# EAGLE board MDE-DR-4 (EAGLE 6.4), part 1 of 3
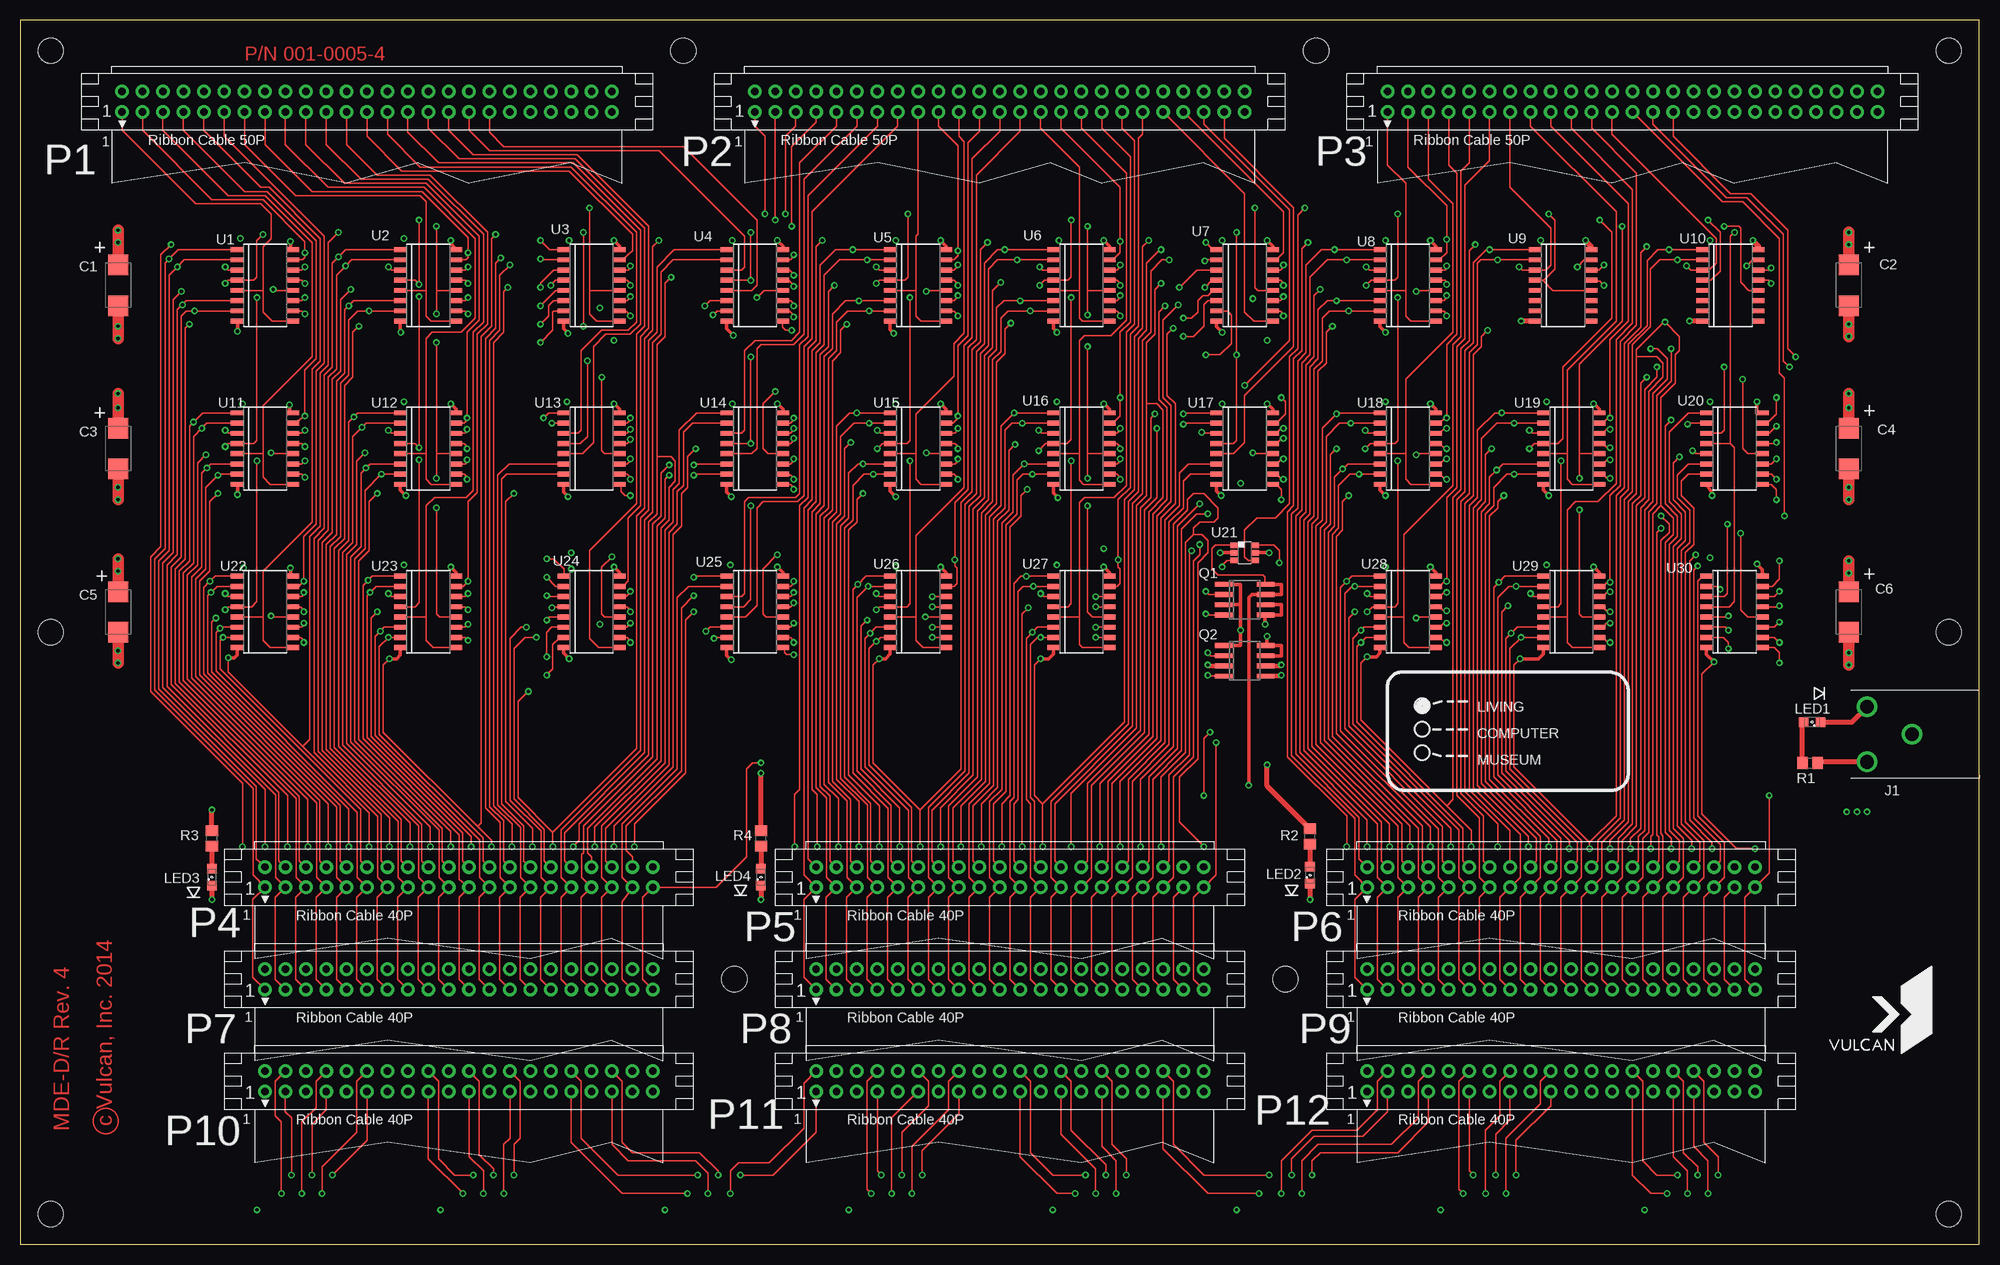
[diagram p4: board, top side]
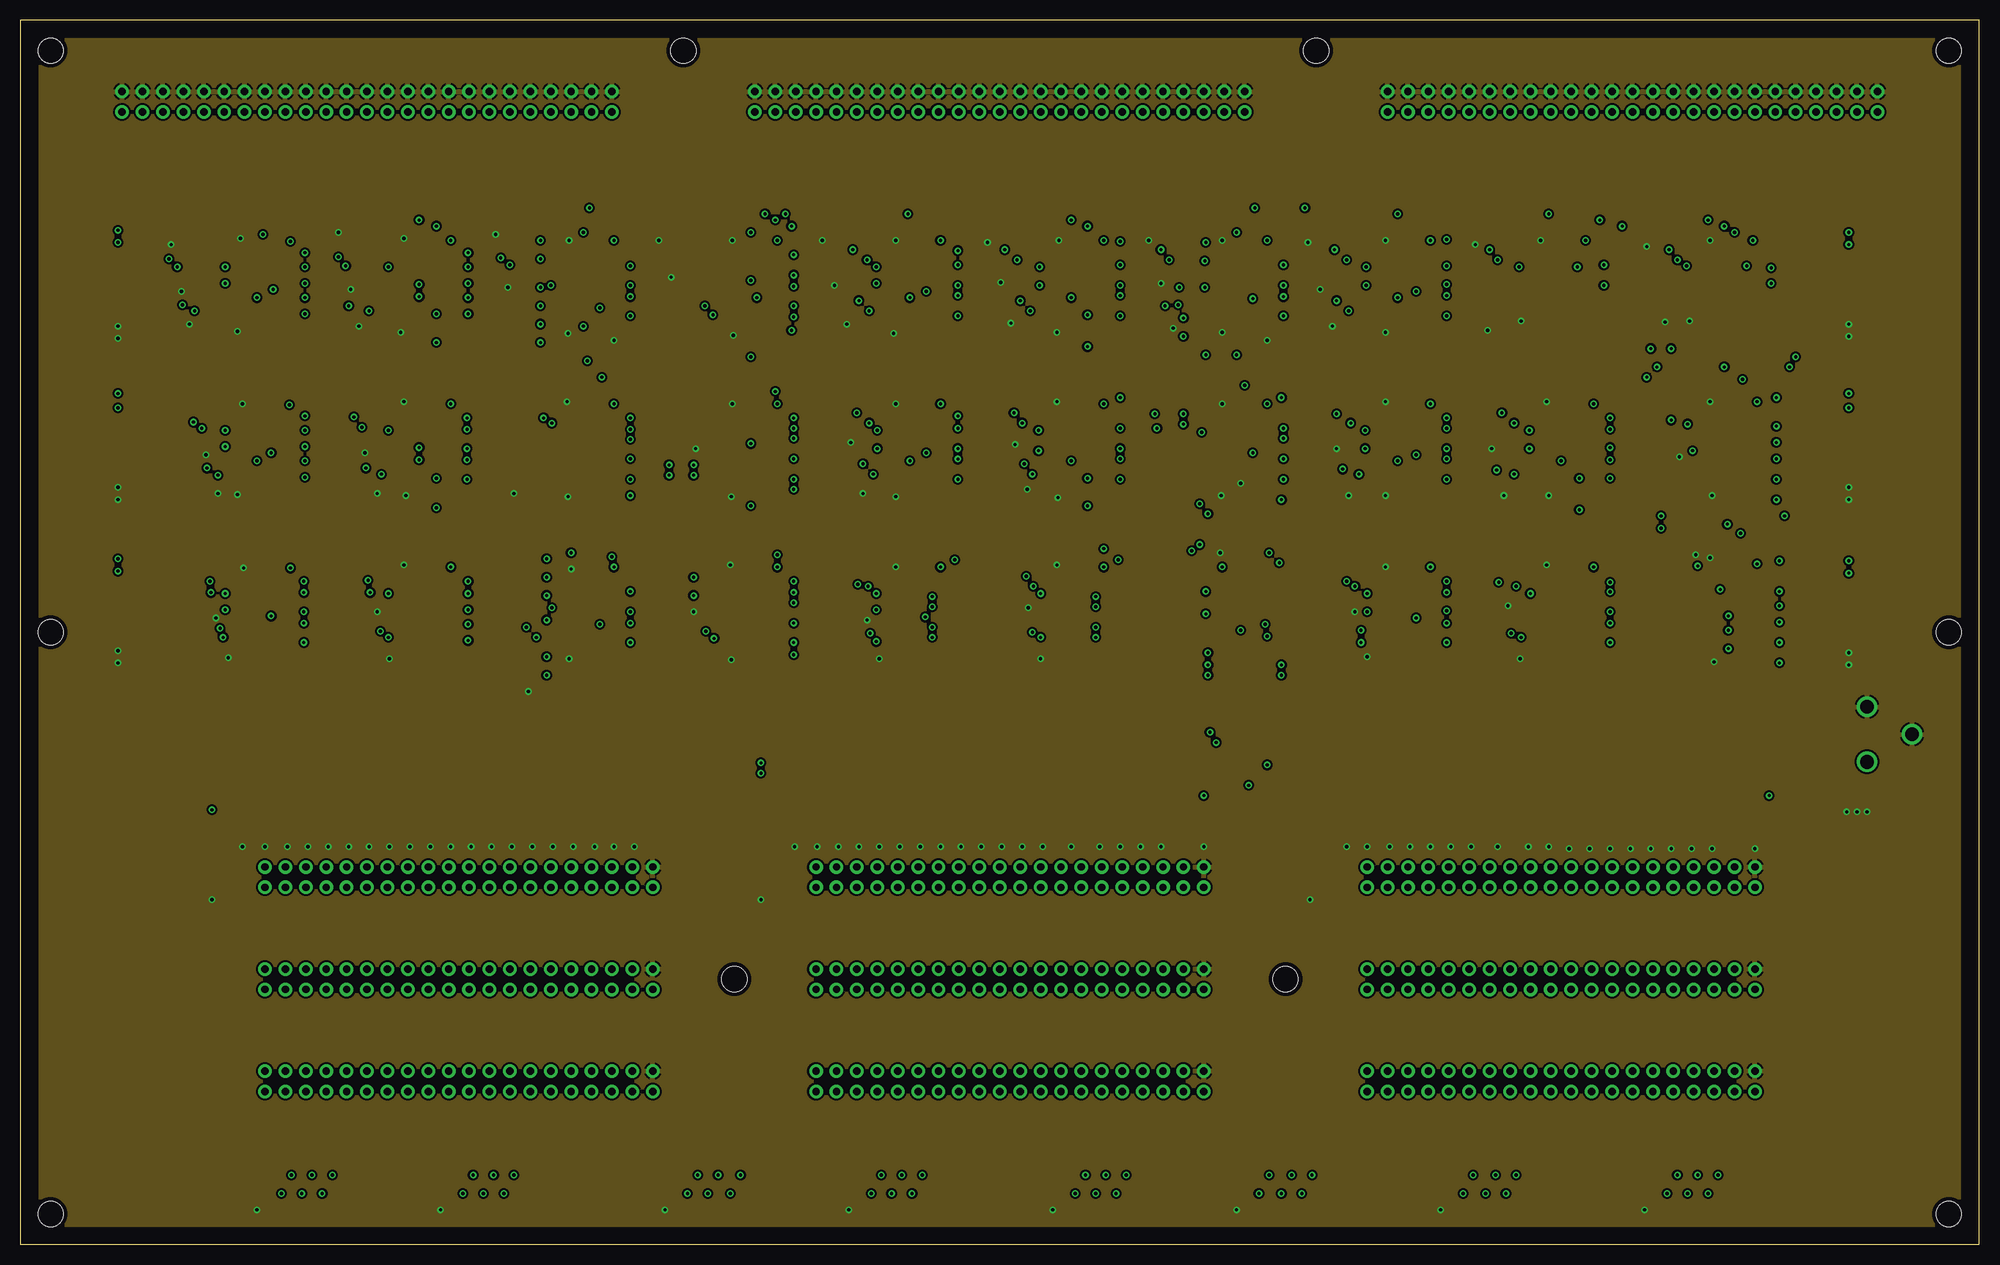
[diagram p5: board, inner layer GND]
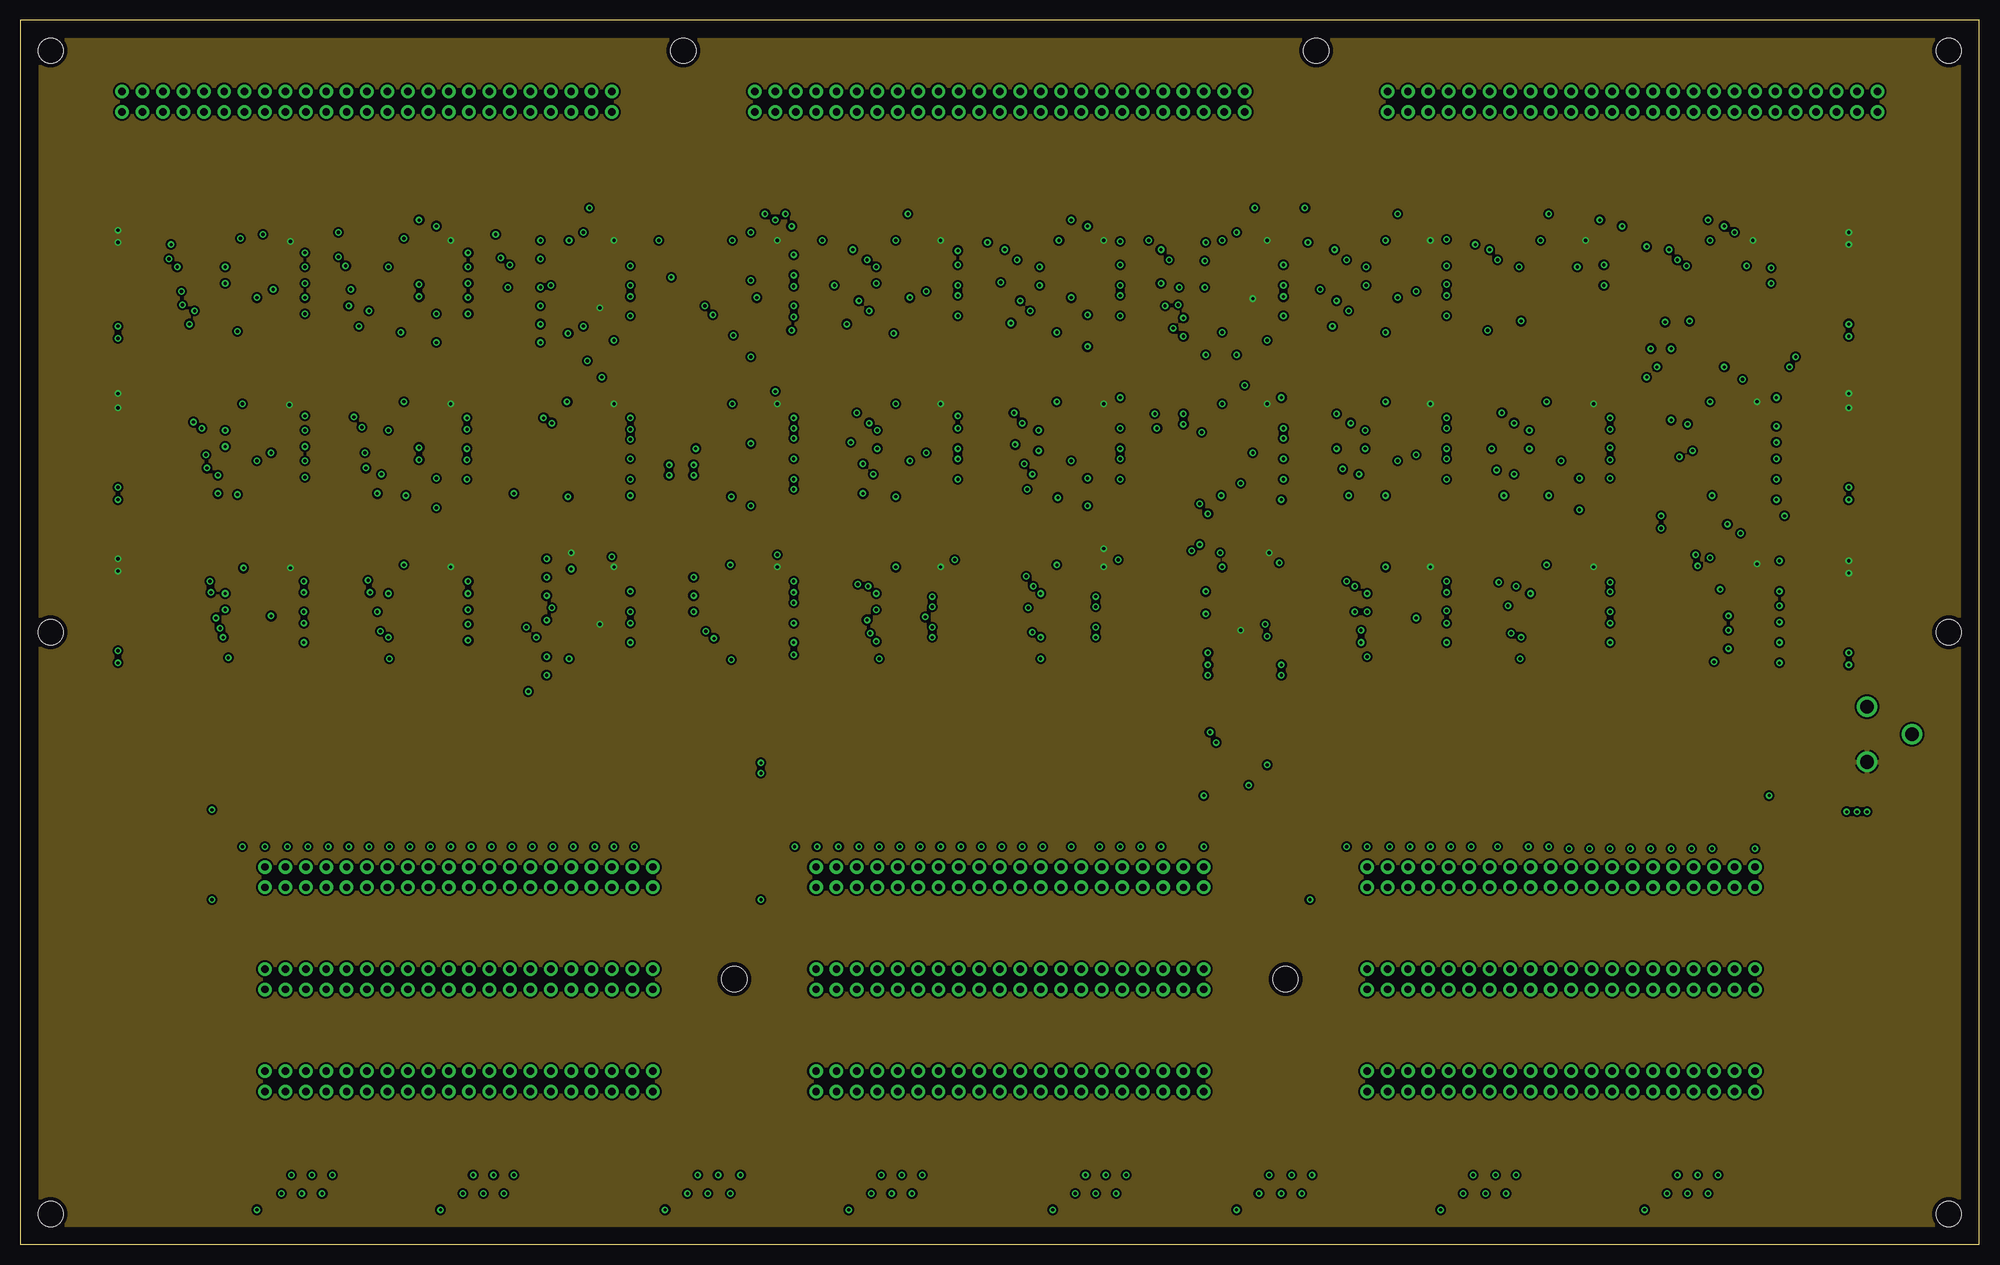
[diagram p6: board, inner layer PWR]
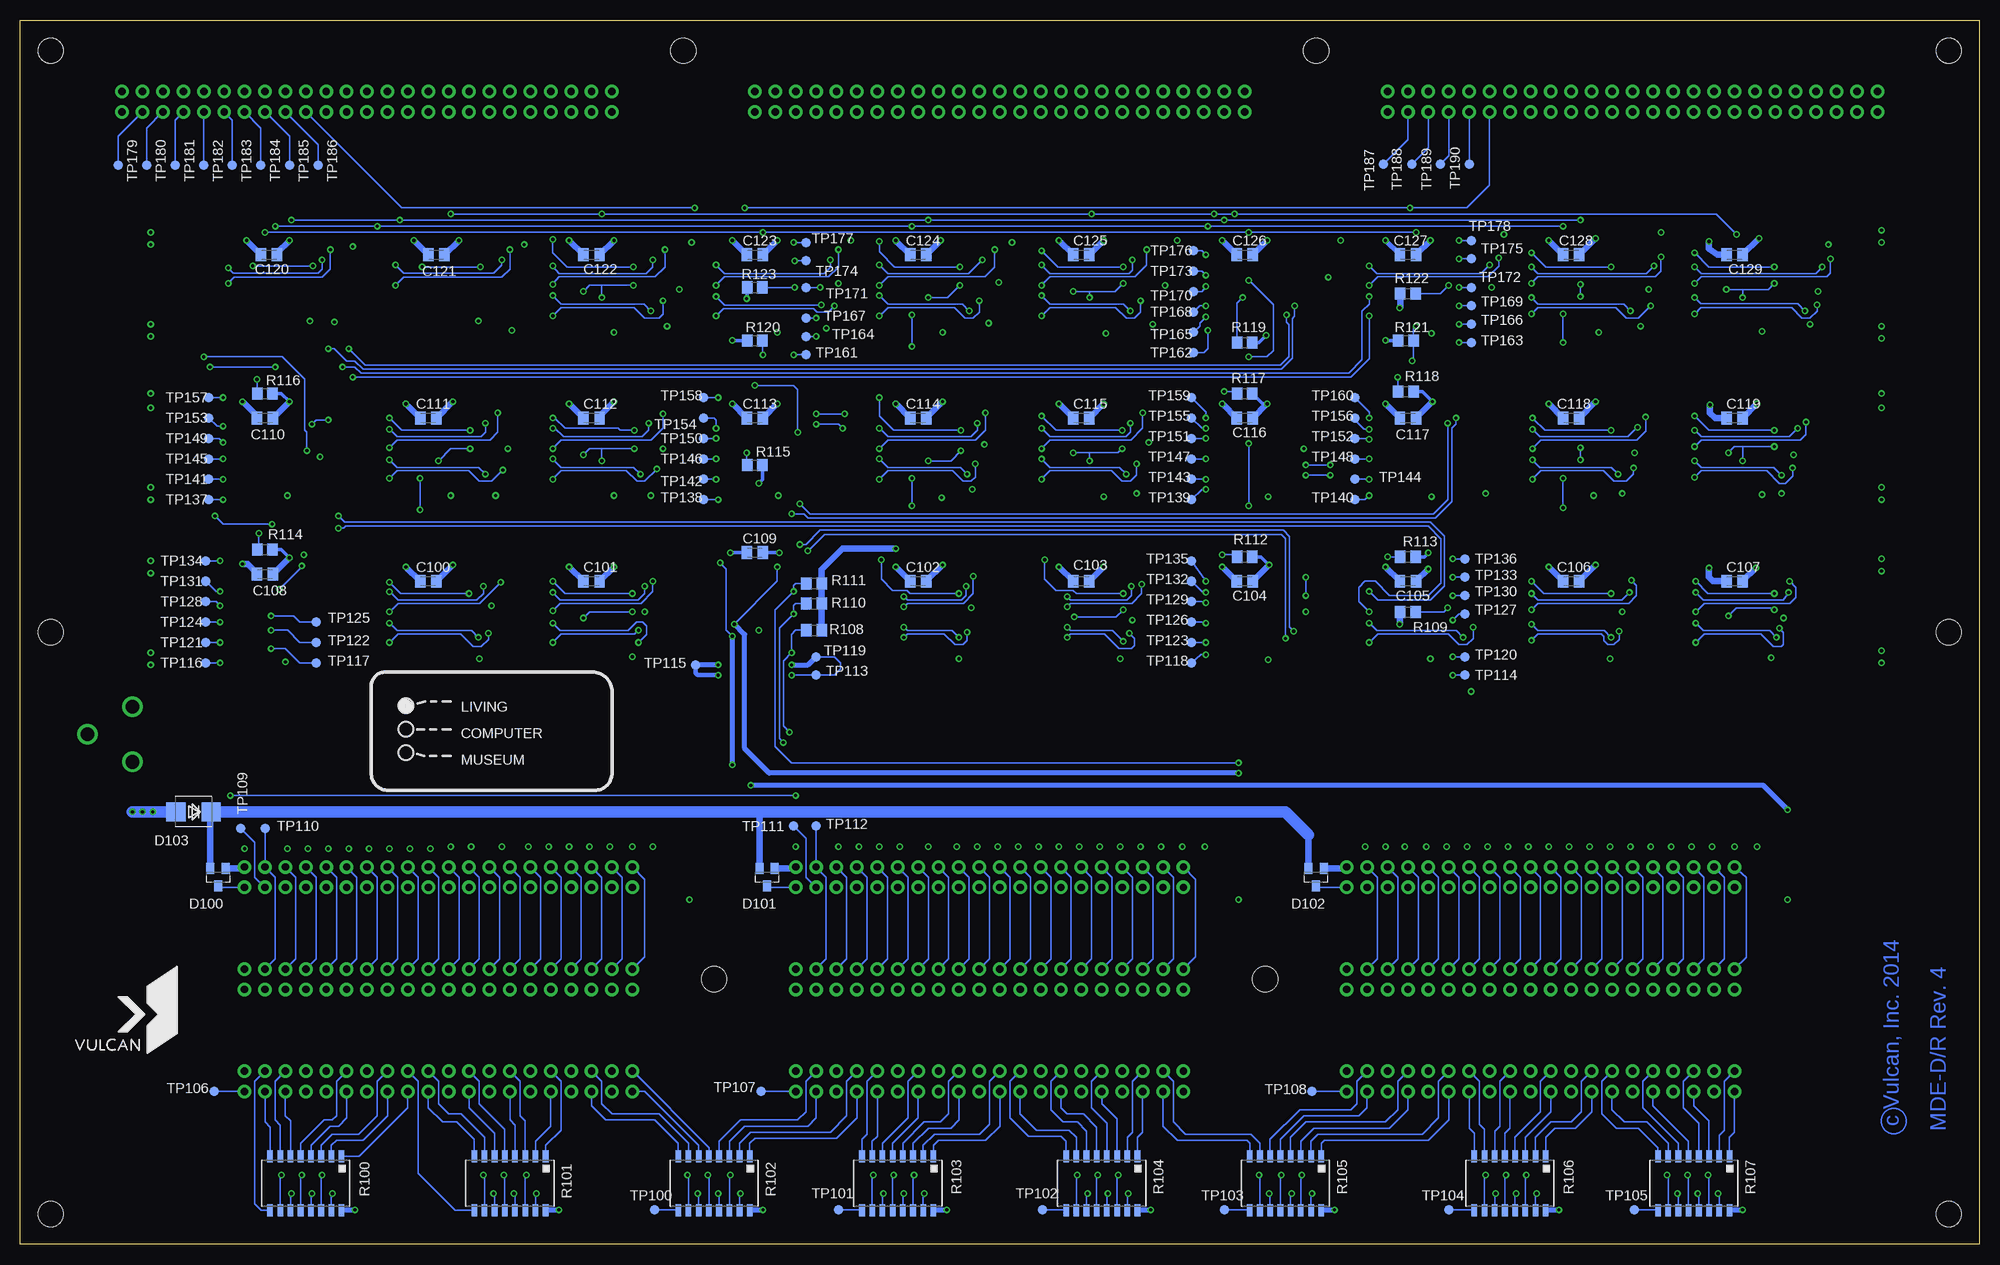
[diagram p7: board, bottom side, seen from below]

Size 243.84 x 152.4 mm. Coordinates in mm from the lower left corner, seen from the top.
Outline: 0,0 243.84,0 243.84,152.4 0,152.4 0,0
Copper layers (1+2*3+16): Top 0.035mm / dielectric 1.5mm / GND 0.035mm / dielectric 0.15mm / PWR 0.035mm / dielectric 0.2mm / Bottom 0.035mm
Design rules "dd60i *": minimum track width 8mil, minimum drill 16mil, track to track 8mil, track to pad 8mil, pad to pad 8mil, via to via 8mil, smd to smd 8mil, copper to edge 0.5mm, drill to drill 0.5mm, minimum pad ring 10mil, minimum via ring 8mil, stop-mask expansion 4mil, vias tented up to drill 20mil, thermal gap 10mil
Holes 3.17 mm at 3.81,3.81 240.03,3.81 240.03,148.59 3.81,148.59 3.81,76.2 240.03,76.2 88.9,33.02 157.48,33.02 82.55,148.59 161.29,148.59

## Footprints (pad centres in the part's own frame; a part is rotated, then mirrored left to right if it is on the bottom)
C/6032-28R = smd 2.55 x 2.5: + 2.525,0; - -2.525,0
C0805K = smd 1.3 x 1.6: 1 -1,0; 2 1,0
SOT23 = smd 1 x 1.4: 1 -0.95,-1.1; 2 0.95,-1.1; 3 0,1.1
SMB = smd 2.4 x 2.4: A 2.2,0; C -2.2,0
712RA = drill 1.702: PIN 0,3.429; SLEEVE -5.588,0; SLEEVE_SHUNT 0,-3.429
SML0805 = smd 1.2 x 1.2: A 1.05,0; C -1.05,0
CON50L = drill 0.914 pad 1.676: 1 30.48,1.27; 2 30.48,-1.27; 3 27.94,1.27; 4 27.94,-1.27; 5 25.4,1.27; 6 25.4,-1.27; 7 22.86,1.27; 8 22.86,-1.27; 9 20.32,1.27; 10 20.32,-1.27; 11 17.78,1.27; 12 17.78,-1.27; 13 15.24,1.27; 14 15.24,-1.27; 15 12.7,1.27; 16 12.7,-1.27; 17 10.16,1.27; 18 10.16,-1.27; 19 7.62,1.27; 20 7.62,-1.27; 21 5.08,1.27; 22 5.08,-1.27; 23 2.54,1.27; 24 2.54,-1.27; 25 0,1.27; 26 0,-1.27; 27 -2.54,1.27; 28 -2.54,-1.27; 29 -5.08,1.27; 30 -5.08,-1.27; 31 -7.62,1.27; 32 -7.62,-1.27; 33 -10.16,1.27; 34 -10.16,-1.27; 35 -12.7,1.27; 36 -12.7,-1.27; 37 -15.24,1.27; 38 -15.24,-1.27; 39 -17.78,1.27; 40 -17.78,-1.27; 41 -20.32,1.27; 42 -20.32,-1.27; 43 -22.86,1.27; 44 -22.86,-1.27; 45 -25.4,1.27; 46 -25.4,-1.27; 47 -27.94,1.27; 48 -27.94,-1.27; 49 -30.48,1.27; 50 -30.48,-1.27
CON40L = drill 0.914 pad 1.676: 1 24.13,1.27; 2 24.13,-1.27; 3 21.59,1.27; 4 21.59,-1.27; 5 19.05,1.27; 6 19.05,-1.27; 7 16.51,1.27; 8 16.51,-1.27; 9 13.97,1.27; 10 13.97,-1.27; 11 11.43,1.27; 12 11.43,-1.27; 13 8.89,1.27; 14 8.89,-1.27; 15 6.35,1.27; 16 6.35,-1.27; 17 3.81,1.27; 18 3.81,-1.27; 19 1.27,1.27; 20 1.27,-1.27; 21 -1.27,1.27; 22 -1.27,-1.27; 23 -3.81,1.27; 24 -3.81,-1.27; 25 -6.35,1.27; 26 -6.35,-1.27; 27 -8.89,1.27; 28 -8.89,-1.27; 29 -11.43,1.27; 30 -11.43,-1.27; 31 -13.97,1.27; 32 -13.97,-1.27; 33 -16.51,1.27; 34 -16.51,-1.27; 35 -19.05,1.27; 36 -19.05,-1.27; 37 -21.59,1.27; 38 -21.59,-1.27; 39 -24.13,1.27; 40 -24.13,-1.27
SO-08 = smd 0.6 x 2.2: 1 -1.905,-2.6; 2 -0.635,-2.6; 3 0.635,-2.6; 4 1.905,-2.6; 5 1.905,2.6; 6 0.635,2.6; 7 -0.635,2.6; 8 -1.905,2.6
R0805 = smd 1.3 x 1.5: 1 -0.95,0; 2 0.95,0
4816P = smd 0.7 x 1.5: 1 -4.445,-3.346; 2 -3.175,-3.346; 3 -1.905,-3.346; 4 -0.635,-3.346; 5 0.635,-3.346; 6 1.905,-3.346; 7 3.175,-3.346; 8 4.445,-3.346; 9 4.445,3.346; 10 3.175,3.346; 11 1.905,3.346; 12 0.635,3.346; 13 -0.635,3.346; 14 -1.905,3.346; 15 -3.175,3.346; 16 -4.445,3.346
TP12R = smd 1.2 x 1.2: TP 0,0
SO16NS = smd 0.6 x 1.5: 1 -4.445,-3.49; 2 -3.175,-3.49; 3 -1.905,-3.49; 4 -0.635,-3.49; 5 0.635,-3.49; 6 1.905,-3.49; 7 3.175,-3.49; 8 4.445,-3.49; 9 4.445,3.49; 10 3.175,3.49; 11 1.905,3.49; 12 0.635,3.49; 13 -0.635,3.49; 14 -1.905,3.49; 15 -3.175,3.49; 16 -4.445,3.49
DBV_R-PDSO-G6 = smd 0.69 x 0.99: 1 -0.95,-1.29; 2 0,-1.29; 3 0.95,-1.29; 4 0.95,1.3; 5 0,1.3; 6 -0.95,1.3

## Placement (x,y rotation side)
C1  47u  [C/6032-28R]  12.19,119.38 90 top
C2  47u  [C/6032-28R]  227.58,119.38 90 top
C3  47u  [C/6032-28R]  12.19,99.06 90 top
C4  47u  [C/6032-28R]  227.58,99.06 90 top
C5  47u  [C/6032-28R]  12.19,78.74 90 top
C6  47u  [C/6032-28R]  227.58,78.74 90 top
C100  0.01u  [C0805K]  193.04,82.55 0 bottom
C101  0.01u  [C0805K]  172.72,82.55 0 bottom
C102  0.01u  [C0805K]  132.08,82.55 0 bottom
C103  0.01u  [C0805K]  111.76,82.55 0 bottom
C104  0.01u  [C0805K]  91.44,82.55 0 bottom
C105  0.01u  [C0805K]  71.12,82.55 0 bottom
C106  0.01u  [C0805K]  50.8,82.55 0 bottom
C107  0.01u  [C0805K]  30.48,82.55 0 bottom
C108  0.01u  [C0805K]  213.36,83.44 0 bottom
C109  0.01u  [C0805K]  152.4,86.11 0 bottom
C110  0.01u  [C0805K]  213.36,102.87 0 bottom
C111  0.01u  [C0805K]  193.04,102.87 0 bottom
C112  0.01u  [C0805K]  172.72,102.87 0 bottom
C113  0.01u  [C0805K]  152.4,102.87 0 bottom
C114  0.01u  [C0805K]  132.08,102.87 0 bottom
C115  0.01u  [C0805K]  111.76,102.87 0 bottom
C116  0.01u  [C0805K]  91.44,102.87 0 bottom
C117  0.01u  [C0805K]  71.12,102.87 0 bottom
C118  0.01u  [C0805K]  50.8,102.87 0 bottom
C119  0.01u  [C0805K]  30.48,102.87 0 bottom
C120  0.01u  [C0805K]  212.85,123.19 0 bottom
C121  0.01u  [C0805K]  192.02,123.19 0 bottom
C122  0.01u  [C0805K]  172.72,123.19 0 bottom
C123  0.01u  [C0805K]  152.4,123.19 0 bottom
C124  0.01u  [C0805K]  132.08,123.19 0 bottom
C125  0.01u  [C0805K]  111.76,123.19 0 bottom
C126  0.01u  [C0805K]  91.44,123.19 0 bottom
C127  0.01u  [C0805K]  71.12,123.19 0 bottom
C128  0.01u  [C0805K]  50.8,123.19 0 bottom
C129  0.01u  [C0805K]  30.48,123.19 0 bottom
D100  HSMS-2822  [SOT23]  219.2,45.72 180 bottom
D101  HSMS-2822  [SOT23]  150.88,45.72 180 bottom
D102  HSMS-2822  [SOT23]  82.55,45.72 180 bottom
D103  1SMB5918BT3G  [SMB]  222.25,53.85 180 bottom
DRILEGEND  [DRILEGEND]  41.59,-11.49 0 top  (outside the outline)
J1  712RA  [712RA]  229.87,63.5 180 top
LED1  APT2012SGC  [SML0805]  223.01,65.02 180 top
LED2  APT2012EC  [SML0805]  160.53,45.97 90 top
LED3  APT2012EC  [SML0805]  23.88,45.72 90 top
LED4  APT2012EC  [SML0805]  92.2,45.72 90 top
P1  [CON50L]  43.18,142.24 180 top
P2  [CON50L]  121.92,142.24 180 top
P3  [CON50L]  200.66,142.24 180 top
P4  [CON40L]  54.61,45.72 180 top
P5  [CON40L]  123.19,45.72 180 top
P6  [CON40L]  191.77,45.72 180 top
P7  [CON40L]  54.61,33.02 180 top
P8  [CON40L]  123.19,33.02 180 top
P9  [CON40L]  191.77,33.02 180 top
P10  [CON40L]  54.61,20.32 180 top
P11  [CON40L]  123.19,20.32 180 top
P12  [CON40L]  191.77,20.32 180 top
Q1  IRF7104PBF  [SO-08]  152.4,80.26 270 top
Q2  IRF7104PBF  [SO-08]  152.4,72.64 270 top
R1  150  [R0805]  222.76,59.94 0 top
R2  150  [R0805]  160.53,50.8 90 top
R3  150  [R0805]  23.88,50.55 90 top
R4  150  [R0805]  92.2,50.55 90 top
R100  4816P-T02-820LF  [4816P]  208.28,7.62 180 bottom
R101  4816P-T02-820LF  [4816P]  182.88,7.62 180 bottom
R102  4816P-T02-820LF  [4816P]  157.48,7.62 180 bottom
R103  4816P-T02-820LF  [4816P]  134.62,7.62 180 bottom
R104  4816P-T02-820LF  [4816P]  109.22,7.62 180 bottom
R105  4816P-T02-820LF  [4816P]  86.36,7.62 180 bottom
R106  4816P-T02-820LF  [4816P]  58.42,7.62 180 bottom
R107  4816P-T02-820LF  [4816P]  35.56,7.62 180 bottom
R108  10k  [R0805]  145.03,76.45 0 bottom
R109  1.0k  [R0805]  71.12,78.74 0 bottom
R110  10k  [R0805]  145.03,79.76 0 bottom
R111  10k  [R0805]  145.03,82.3 0 bottom
R112  1.0k  [R0805]  91.44,85.6 0 bottom
R113  1.0k  [R0805]  71.12,85.6 0 bottom
R114  1.0k  [R0805]  213.36,86.49 0 bottom
R115  1.0k  [R0805]  152.4,97.03 0 bottom
R116  1.0k  [R0805]  213.36,105.92 0 bottom
R117  1.0k  [R0805]  91.44,105.92 0 bottom
R118  1.0k  [R0805]  71.37,106.17 0 bottom
R119  1.0k  [R0805]  91.44,112.27 0 bottom
R120  1.0k  [R0805]  152.4,112.52 0 bottom
R121  1.0k  [R0805]  71.37,112.52 0 bottom
R122  1.0k  [R0805]  71.12,118.36 0 bottom
R123  1.0k  [R0805]  152.4,119.13 0 bottom
TP100  TPSTP12R  [TP12R]  164.85,4.32 0 bottom
TP101  TPSTP12R  [TP12R]  141.99,4.32 0 bottom
TP102  TPSTP12R  [TP12R]  116.59,4.32 0 bottom
TP103  TPSTP12R  [TP12R]  93.98,4.32 0 bottom
TP104  TPSTP12R  [TP12R]  66.04,4.32 0 bottom
TP105  TPSTP12R  [TP12R]  42.93,4.32 0 bottom
TP106  TPSTP12R  [TP12R]  219.71,19.05 0 bottom
TP107  TPSTP12R  [TP12R]  151.64,19.05 0 bottom
TP108  TPSTP12R  [TP12R]  83.06,19.05 0 bottom
TP109  TPSTP12R  [TP12R]  216.41,51.82 90 bottom
TP110  TPSTP12R  [TP12R]  213.36,51.82 90 bottom
TP111  TPSTP12R  [TP12R]  147.57,52.07 0 bottom
TP112  TPSTP12R  [TP12R]  144.78,52.07 0 bottom
TP113  TPSTP12R  [TP12R]  144.78,70.87 270 bottom
TP114  TPSTP12R  [TP12R]  64.01,70.87 0 bottom
TP115  TPSTP12R  [TP12R]  159.77,72.14 270 bottom
TP116  TPSTP12R  [TP12R]  220.73,72.39 0 bottom
TP117  TPSTP12R  [TP12R]  207.01,72.39 270 bottom
TP118  TPSTP12R  [TP12R]  98.04,72.39 0 bottom
TP119  TPSTP12R  [TP12R]  144.78,73.15 270 bottom
TP120  TPSTP12R  [TP12R]  64.01,73.15 0 bottom
TP121  TPSTP12R  [TP12R]  220.73,74.93 0 bottom
TP122  TPSTP12R  [TP12R]  207.01,74.93 270 bottom
TP123  TPSTP12R  [TP12R]  98.04,74.93 0 bottom
TP124  TPSTP12R  [TP12R]  220.73,77.47 0 bottom
TP125  TPSTP12R  [TP12R]  207.01,77.47 0 bottom
TP126  TPSTP12R  [TP12R]  98.04,77.47 0 bottom
TP127  TPSTP12R  [TP12R]  64.01,78.49 0 bottom
TP128  TPSTP12R  [TP12R]  220.73,80.01 0 bottom
TP129  TPSTP12R  [TP12R]  98.04,80.01 0 bottom
TP130  TPSTP12R  [TP12R]  64.01,80.77 0 bottom
TP131  TPSTP12R  [TP12R]  220.73,82.55 0 bottom
TP132  TPSTP12R  [TP12R]  98.04,82.55 0 bottom
TP133  TPSTP12R  [TP12R]  64.01,83.06 0 bottom
TP134  TPSTP12R  [TP12R]  220.73,85.09 0 bottom
TP135  TPSTP12R  [TP12R]  98.04,85.09 0 bottom
TP136  TPSTP12R  [TP12R]  64.01,85.34 0 bottom
TP137  TPSTP12R  [TP12R]  220.34,92.71 0 bottom
TP138  TPSTP12R  [TP12R]  158.75,92.71 0 bottom
TP139  TPSTP12R  [TP12R]  98.04,92.71 0 bottom
TP140  TPSTP12R  [TP12R]  77.72,92.71 0 bottom
TP141  TPSTP12R  [TP12R]  220.34,95.25 0 bottom
TP142  TPSTP12R  [TP12R]  158.75,95.25 0 bottom
TP143  TPSTP12R  [TP12R]  98.04,95.25 0 bottom
TP144  TPSTP12R  [TP12R]  77.72,95.25 0 bottom
TP145  TPSTP12R  [TP12R]  220.34,97.79 0 bottom
TP146  TPSTP12R  [TP12R]  158.75,97.79 0 bottom
TP147  TPSTP12R  [TP12R]  98.04,97.79 0 bottom
TP148  TPSTP12R  [TP12R]  77.72,97.79 0 bottom
TP149  TPSTP12R  [TP12R]  220.34,100.33 0 bottom
TP150  TPSTP12R  [TP12R]  158.75,100.33 0 bottom
TP151  TPSTP12R  [TP12R]  98.04,100.33 0 bottom
TP152  TPSTP12R  [TP12R]  77.72,100.33 0 bottom
TP153  TPSTP12R  [TP12R]  220.34,102.87 0 bottom
TP154  TPSTP12R  [TP12R]  158.75,102.87 0 bottom
TP155  TPSTP12R  [TP12R]  98.04,102.87 0 bottom
TP156  TPSTP12R  [TP12R]  77.72,102.87 0 bottom
TP157  TPSTP12R  [TP12R]  220.34,105.41 0 bottom
TP158  TPSTP12R  [TP12R]  158.75,105.41 0 bottom
TP159  TPSTP12R  [TP12R]  98.04,105.41 0 bottom
TP160  TPSTP12R  [TP12R]  77.72,105.41 0 bottom
TP161  TPSTP12R  [TP12R]  146.05,110.74 0 bottom
TP162  TPSTP12R  [TP12R]  97.79,111 0 bottom
TP163  TPSTP12R  [TP12R]  63.25,112.27 0 bottom
TP164  TPSTP12R  [TP12R]  146.05,113.03 0 bottom
TP165  TPSTP12R  [TP12R]  97.79,113.54 0 bottom
TP166  TPSTP12R  [TP12R]  63.25,114.55 0 bottom
TP167  TPSTP12R  [TP12R]  146.05,115.32 0 bottom
TP168  TPSTP12R  [TP12R]  97.79,116.08 0 bottom
TP169  TPSTP12R  [TP12R]  63.25,116.84 0 bottom
TP170  TPSTP12R  [TP12R]  97.79,118.62 0 bottom
TP171  TPSTP12R  [TP12R]  146.05,119.13 0 bottom
TP172  TPSTP12R  [TP12R]  63.25,119.13 0 bottom
TP173  TPSTP12R  [TP12R]  97.79,121.16 0 bottom
TP174  TPSTP12R  [TP12R]  146.05,122.43 0 bottom
TP175  TPSTP12R  [TP12R]  63.25,122.68 0 bottom
TP176  TPSTP12R  [TP12R]  97.79,123.7 0 bottom
TP177  TPSTP12R  [TP12R]  146.05,124.71 0 bottom
TP178  TPSTP12R  [TP12R]  63.25,124.97 0 bottom
TP179  TPSTP12R  [TP12R]  231.65,134.37 90 bottom
TP180  TPSTP12R  [TP12R]  228.09,134.37 90 bottom
TP181  TPSTP12R  [TP12R]  224.54,134.37 90 bottom
TP182  TPSTP12R  [TP12R]  220.98,134.37 90 bottom
TP183  TPSTP12R  [TP12R]  217.42,134.37 90 bottom
TP184  TPSTP12R  [TP12R]  213.87,134.37 90 bottom
TP185  TPSTP12R  [TP12R]  210.31,134.37 90 bottom
TP186  TPSTP12R  [TP12R]  206.76,134.37 90 bottom
TP187  TPSTP12R  [TP12R]  74.17,134.49 270 bottom
TP188  TPSTP12R  [TP12R]  70.61,134.49 270 bottom
TP189  TPSTP12R  [TP12R]  67.06,134.49 270 bottom
TP190  TPSTP12R  [TP12R]  63.5,134.49 270 bottom
U1  SN751177NSR"  [SO16NS]  30.48,119.38 270 top
U2  SN751177NSR"  [SO16NS]  50.8,119.38 270 top
U3  SN751177NSR"  [SO16NS]  71.12,119.38 270 top
U4  SN751177NSR"  [SO16NS]  91.44,119.38 270 top
U5  SN751177NSR"  [SO16NS]  111.76,119.38 270 top
U6  SN751177NSR"  [SO16NS]  132.08,119.38 270 top
U7  SN751177NSR"  [SO16NS]  152.4,119.38 270 top
U8  SN751177NSR"  [SO16NS]  172.72,119.38 270 top
U9  SN751177NSR"  [SO16NS]  192.02,119.38 270 top
U10  SN751177NSR"  [SO16NS]  212.85,119.38 270 top
U11  SN751177NSR"  [SO16NS]  30.48,99.06 270 top
U12  SN751177NSR"  [SO16NS]  50.8,99.06 270 top
U13  SN751177NSR"  [SO16NS]  71.12,99.06 270 top
U14  SN751177NSR"  [SO16NS]  91.44,99.06 270 top
U15  SN751177NSR"  [SO16NS]  111.76,99.06 270 top
U16  SN751177NSR"  [SO16NS]  132.08,99.06 270 top
U17  SN751177NSR"  [SO16NS]  152.4,99.06 270 top
U18  SN751177NSR"  [SO16NS]  172.72,99.06 270 top
U19  SN751177NSR"  [SO16NS]  193.04,99.06 270 top
U20  SN751177NSR"  [SO16NS]  213.36,99.06 270 top
U21  SN74LVC1G27DBV  [DBV_R-PDSO-G6]  152.4,86.11 270 top
U22  SN751177NSR"  [SO16NS]  30.48,78.74 270 top
U23  SN751177NSR"  [SO16NS]  50.8,78.74 270 top
U24  SN751177NSR"  [SO16NS]  71.12,78.74 270 top
U25  SN751177NSR"  [SO16NS]  91.44,78.74 270 top
U26  SN751177NSR"  [SO16NS]  111.76,78.74 270 top
U27  SN751177NSR"  [SO16NS]  132.08,78.74 270 top
U28  SN751177NSR"  [SO16NS]  172.72,78.74 270 top
U29  SN751177NSR"  [SO16NS]  193.04,78.74 270 top
U30  SN751177NSR"  [SO16NS]  213.36,78.74 270 top

## Tracks (layer width: path | path; a pad name or v marks a point on that pad's centre or on a via)
!IF_CTRL_RCV_EN  (via drill 0.41)
  Top 0.203: v70.1,114.3 v70.1,125.98 | v90.93,125.98 v90.93,120.02 U4.4 | U13.4 69.72,99.69 70.61,100.58 v70.61,109.98 | U14.4 v90.93,99.69 v90.93,110.49 | U25.4 90.04,79.38 90.93,80.26 v90.93,91.95 | v151.38,125.98 v151.38,110.74 151.38,100.08 151,99.69 U17.4 | U30.4 212.72,79.38 213.36,80.01 213.36,99.19 212.85,99.69 | 212.85,99.69 212.85,125.48 v213.36,125.98 | U20.4 212.85,99.69
  Bottom 0.203: v70.1,125.98 v90.93,125.98 v151.38,125.98 v213.36,125.98 | v70.1,114.3 70.42,113.98 R121.2 70.42,110.17 v70.61,109.98 | v90.93,110.49 88.65,110.49 87.88,111.25 87.88,116.97 v90.93,120.02 | v90.93,91.95 v90.93,99.69 | R120.2 151.45,110.81 v151.38,110.74
+5V  (via drill 0.41)
  Top 0.406: U2.16 53.45,124.82 v53.59,124.97 | Q1.1 151.89,82.17 151.89,79.63 | Q1.3 151.89,79.63 | Q2.1 151.89,74.55 v151.89,76.45 151.89,79.63 | U21.5 v155.45,86.11 | v216.15,104.9 216.15,103.5 U20.16 | 223.84,60.07 R1.2 | U1.16 33.66,123.83 v33.66,124.84 | v33.53,104.52 33.53,103.5 U11.16 | v33.66,84.2 33.66,83.19 U22.16 | v53.59,84.33 54.29,83.63 U23.16 | U12.16 54.29,103.95 v53.59,104.65 | v73.91,124.97 74.61,124.27 U3.16 | U13.16 74.61,103.95 v73.91,104.65 | U24.16 74.61,83.63 v73.91,84.33 | U25.16 94.93,83.63 v94.23,84.33 | U14.16 94.93,103.95 v94.23,104.65 | U4.16 94.93,124.27 v94.23,124.97 | U5.16 115.25,124.27 v114.55,124.97 | U15.16 115.25,103.95 v114.55,104.65 | U26.16 115.25,83.63 v114.55,84.33 | U27.16 135.57,83.63 v134.87,84.33 | U16.16 135.57,103.95 v134.87,104.65 | U6.16 135.57,124.27 v134.87,124.97 | U7.16 155.89,124.27 v155.19,124.97 | U17.16 155.89,103.95 v155.19,104.65 | U8.16 176.21,124.27 v175.51,124.97 | U18.16 176.21,103.95 v175.51,104.65 | U28.16 176.21,83.63 v175.51,84.33 | U29.16 196.53,83.63 v195.83,84.33 | U19.16 196.53,103.95 v195.83,104.65 | U30.16 216.85,84.01 v216.15,84.71
  Top 0.61: J1.PIN 223.84,60.07 | v194.82,124.97 195.51,124.27 U9.16 | v215.65,124.97 216.34,124.27 U10.16
  Top 1.422: C1.+ v12.19,126.24 | C3.+ v12.19,105.92 | C5.+ v12.19,85.34 | C2.+ v227.58,125.98 | C4.+ v227.58,105.92 | C6.+ v227.58,85.09
  Bottom 0.203: C129.1 31.5,123.19
  Bottom 0.406: R113.2 69.09,85.6 v68.58,86.11 | 153.65,122.94 C123.1 | 154.94,86.11 v155.45,86.11 C109.1 | R123.1 153.35,117.92 v153.42,117.73
  Bottom 0.61: C127.1 72.14,123.19 v73.91,124.97
  Bottom 0.813: 31.5,123.19 32.64,123.19 33.66,123.95 v33.66,124.84 | v33.53,104.52 33.53,103.5 32.89,102.87 C119.1 | C107.1 33.15,82.55 33.66,83.06 v33.66,84.2 | v53.59,124.97 51.82,123.19 C128.1 | v53.59,104.65 51.82,102.87 C118.1 | v53.59,84.33 51.82,82.55 C106.1 | C117.1 72.14,102.87 v73.91,104.65 | C105.1 72.14,82.55 v73.91,84.33 | C104.1 92.46,82.55 v94.23,84.33 | C116.1 94.22,104.65 v94.23,104.65 | C126.1 94.22,124.97 v94.23,124.97 | C103.1 114.54,84.33 v114.55,84.33 | C115.1 114.54,104.65 v114.55,104.65 | C125.1 114.54,124.97 v114.55,124.97 | C124.1 133.1,123.19 v134.87,124.97 | C114.1 134.86,104.65 v134.87,104.65 | C102.1 134.86,84.33 v134.87,84.33 | C123.1 153.42,123.19 v155.19,124.97 | R122.1 72.07,116.65 v72.14,116.59 | R109.1 72.14,78.67 v72.14,77.22 | C113.1 153.42,102.87 v155.19,104.65 | R108.2 R110.2 R111.2 144.08,84.01 141.48,86.61 v134.87,86.61 | C122.1 173.74,123.19 v175.51,124.97 | C112.1 173.74,102.87 v175.51,104.65 | C101.1 173.74,82.55 v175.51,84.33 | C121.1 193.04,123.19 v194.82,124.97 | C111.1 194.06,102.87 v195.83,104.65 | C100.1 194.06,82.55 v195.83,84.33 | C108.1 214.36,83.68 214.5,83.69 215.52,84.71 v216.15,84.71 | C110.1 214.36,103.11 v216.15,104.9 | C120.1 213.87,123.19 v215.65,124.97
  other vias: 12.19,124.71 12.19,104.14 12.19,83.82 227.58,124.46 227.58,104.14 227.58,83.57
  pour PWR (isolate 0.254): 2.54,2.54 241.3,2.54 241.3,149.86 2.54,149.86
CABLE_A_FAIL  (via drill 0.41)
  Top 0.203: v92.2,59.94 91.19,59.94 90.42,59.18 90.42,48.26 86.61,44.45 P4.39 77.47,43.18 77.47,33.02 P7.39 | Q1.2 147.96,80.9 v147.57,81.28
  Bottom 0.203: P4.39 82.38,44.45 D102.3 | v92.2,59.94 147.83,59.94 149.86,61.98 149.86,78.99 v147.57,81.28 147.57,82.04 147.32,82.3 R111.1
CABLE_B_FAIL  (via drill 0.41)
  Top 0.203: P8.39 146.05,33.02 146.05,43.18 P5.39 148.84,45.97 v148.84,62.48 | Q1.4 147.7,78.36 v147.57,78.49
  Bottom 0.203: P5.39 150.71,44.45 D101.3 | R110.1 147.32,79.76 147.57,79.5 v147.57,78.49 149.35,76.71 149.35,62.99 v148.84,62.48
CABLE_C_FAIL  (via drill 0.41)
  Top 0.203: P9.39 214.63,33.02 214.63,43.18 P6.39 217.68,46.23 v217.68,55.88 | Q2.2 148.21,73.28 v147.83,73.66 | v147.32,55.88 147.32,62.99 v148.08,63.75
  Bottom 0.203: P6.39 219.03,44.45 D100.3 | R108.1 147.32,76.45 147.83,75.95 v147.83,73.66 148.84,72.64 148.84,64.52 v148.08,63.75 | v217.68,55.88 v147.32,55.88
CLAMP
  Bottom 0.813: D102.2 83.5,50.99 | D101.2 151.83,53.78 151.89,53.85 | D100.2 220.15,53.78 220.22,53.85
  Bottom 1.422: 83.5,50.99 86.36,53.85 151.89,53.85 D103.C 220.22,53.85
CTRL_BUS_EN  (via drill 0.41)
  Top 0.203: 53.85,118.75 U2.12 51.82,118.75 | 51.82,118.75 v51.82,115.82 | v51.82,112.27 51.82,98.42 | U12.12 51.82,98.42 | v51.82,126.75 51.82,118.75 | U23.12 52.2,78.11 51.82,78.49 v51.82,91.69 | v51.82,95.38 51.82,98.42 | U6.12 132.84,118.75 | 132.84,118.75 v132.84,126.75 | U16.12 132.84,98.42 | 132.84,98.42 v132.84,111.76 | v132.84,115.7 132.84,118.75 | U27.12 133.48,78.11 132.84,78.74 v132.84,91.95 | v132.84,95.38 132.84,98.42 | P2.7 99.06,139.7 96.01,136.65 v96.01,126.75 | U19.12 194.06,98.42 | 194.06,98.42 194.06,109.6 199.39,114.94 v199.39,126.75 | U29.12 194.44,78.11 194.06,78.49 v194.06,91.44 | v194.06,95.38 194.06,98.42 | v212.09,126.75 213.87,126.75 214.12,126.49 214.12,119.76 215.14,118.75 U10.12
  Bottom 0.203: v51.82,115.82 v51.82,112.27 | v51.82,126.75 v96.01,126.75 v132.84,126.75 v199.39,126.75 v212.09,126.75 | v51.82,91.69 v51.82,95.38 | v132.84,111.76 v132.84,115.7 | v132.84,91.95 v132.84,95.38 | v194.06,91.44 v194.06,95.38
FROM_MB_CTOD
  Top 0.203: U14.5 91.06,98.42 91.69,99.06 91.69,111.51 92.2,112.01 96.27,112.01 97.54,113.28 97.54,132.59 104.14,139.19 P2.11
FROM_MB_DEM  (via drill 0.41)
  Top 0.203: U30.3 212.09,80.64 212.47,81.03 v212.47,89.66 | v219.58,90.68 219.58,107.82 218.95,108.46 218.95,125.22 214.38,129.79 211.84,129.79 P3.25
  Bottom 0.203: v212.47,89.66 218.57,89.66 v219.58,90.68
FROM_MB_DS00
  Top 0.203: U4.5 91.06,118.75 91.69,119.38 91.69,127.25 91.69,127.51 82.55,136.65 79.76,136.65 60.2,136.65 58.42,138.43 P1.37
FROM_MB_DS01  (via drill 0.41)
  Top 0.203: U20.3 211.71,100.97 212.09,101.35 v212.09,109.22 | v220.22,109.22 219.46,109.98 219.46,125.73 214.88,130.3 212.34,130.3 203.2,139.45 P3.27
  Bottom 0.203: v212.09,109.22 v220.22,109.22
FROM_MB_DS02  (via drill 0.41)
  Top 0.203: U20.5 208.53,98.42 v208.15,98.81 | v220.98,110.49 219.96,111.51 219.96,126.24 215.39,130.81 212.85,130.81 205.74,137.92 P3.29
  Bottom 0.203: v208.15,98.81 208.15,101.09 208.41,101.35 208.41,107.7 211.2,110.49 v220.98,110.49
FROM_MB_FAIL  (via drill 0.41)
  Top 0.203: U21.4 152.84,85.16 152.4,85.6 152.4,88.9 153.92,90.42 156.21,90.42 157.99,92.2 157.99,110.49 159,111.51 159,128.14 v159.89,129.03
  Bottom 0.203: v159.89,129.03 196.34,129.03 P3.31
FROM_MB_INIT
  Top 0.203: U25.5 90.3,78.11 91.69,79.5 91.69,91.69 92.46,92.46 96.77,92.46 97.54,93.22 97.54,111.76 98.55,112.78 98.55,128.52 109.22,139.19 P2.15
FROM_MB_RS00  (via drill 0.41)
  Top 0.203: U17.3 147.19,100.97 v147.07,101.09 | v152.4,106.93 157.99,112.52 157.99,128.78 147.32,139.45 P2.45
  Bottom 0.203: v147.07,101.09 147.07,106.43 147.57,106.93 v152.4,106.93
FROM_MB_RS01
  Top 0.203: U17.5 151,98.42 152.4,99.82 152.4,105.66 158.5,111.76 158.5,129.03 149.86,137.67 P2.47
FROM_MB_RS02
  Top 0.203: U13.3 69.47,100.97 69.85,101.35 69.85,111.25 72.39,113.79 75.69,113.79 76.71,114.81 76.71,125.98 68.58,134.11 49.78,134.11 45.72,138.18 P1.27
FROM_MB_RS03
  Top 0.203: U13.5 69.98,98.42 71.37,99.82 71.37,111.76 72.9,113.28 75.95,113.28 77.22,114.55 77.22,126.24 68.83,134.62 52.07,134.62 48.26,138.43 P1.29
FROM_MB_RS04
  Top 0.203: U4.3 89.79,121.28 90.17,121.67 90.17,125.48 79.5,136.14 58.42,136.14 55.88,138.68 P1.35
FROM_MB_RUN
  Top 0.203: U25.3 89.79,80.64 90.17,81.03 90.17,92.46 90.68,92.96 96.52,92.96 97.03,93.47 97.03,102.11 97.03,112.01 98.04,113.03 98.04,130.56 106.68,139.19 P2.13
FROM_MB_WCLK
  Top 0.203: U14.3 89.79,100.97 90.17,101.35 90.17,111.25 91.44,112.52 96.01,112.52 97.03,113.54 97.03,134.62 101.6,139.19 P2.9
GND  (via drill 0.41)
  Top 0.203: v30.48,49.53 30.48,56.64 17.78,69.34 17.78,84.84 19.05,86.11 19.05,117.6 v20.07,118.62 | v33.27,49.53 33.27,55.88 19.3,69.85 19.3,84.07 20.57,85.34 20.57,114.05 v21.08,114.55 | v27.69,49.53 27.69,57.4 16.26,68.83 16.26,85.6 17.53,86.87 17.53,123.19 v18.8,124.46 | v35.81,49.53 35.81,55.37 20.83,70.36 20.83,83.31 22.1,84.58 22.1,97.28 v23.11,98.3 | v38.35,49.53 38.35,54.86 22.35,70.87 22.35,82.55 23.62,83.82 23.62,92.46 v24.64,93.47 | v40.89,49.53 40.89,54.23 23.88,71.25 23.88,77.47 v24.38,77.98 | v43.43,49.53 43.43,53.72 35.18,61.98 | 35.18,61.98 25.91,71.25 v25.91,73.03 | v39.62,125.98 38.35,124.71 38.35,109.47 37.34,108.46 37.34,89.41 36.07,88.14 36.07,62.87 35.18,61.98 | v45.97,49.53 45.97,53.09 37.59,61.47 37.59,87.38 38.86,88.65 38.86,107.7 39.88,108.71 39.88,117.6 v41.15,118.87 | v48.51,49.53 48.51,52.45 39.12,61.85 39.12,86.61 40.39,87.88 40.39,106.93 41.4,107.95 41.4,113.54 v42.16,114.3 | v51.05,49.53 51.05,51.94 40.64,62.36 40.64,85.85 41.91,87.12 41.91,97.54 v42.93,98.55 | v53.59,49.53 53.59,51.44 42.16,62.87 42.16,85.09 43.43,86.36 43.43,92.46 v44.45,93.47 | v56.13,49.53 56.13,50.8 43.69,63.25 43.69,77.98 v44.45,78.74 | v58.67,49.53 58.67,50.29 56.96,52.01 | 56.96,52.01 45.21,63.75 45.21,72.14 v45.97,72.9 | 56.96,52.01 57.4,52.45 57.4,113.03 58.67,114.3 58.67,125.22 v59.18,125.73 | v61.21,49.53 61.21,52.32 58.93,54.61 58.93,112.27 60.2,113.54 60.2,118.62 v60.71,119.13 | v63.75,49.53 63.75,51.82 60.45,55.12 60.45,92.46 v61.47,93.47 | v66.29,49.53 66.29,51.31 | v63.25,68.83 61.98,67.56 61.98,55.63 66.29,51.31 | 66.29,51.31 76.71,61.72 76.71,90.68 77.72,91.69 77.72,112.78 78.74,113.79 78.74,124.21 v79.5,124.97
  Top 0.203: v68.83,49.53 69.6,50.29 69.6,52.32 78.23,60.96 78.23,89.92 79.25,90.93 79.25,98.04 | 79.25,98.04 79.25,112.01 80.26,113.03 80.26,119.63 v81.03,120.4 | v71.5,49.53 71.5,51.94 79.76,60.2 79.76,89.15 80.77,90.17 80.77,94.23 81.53,95 81.53,97.54 81.03,98.04 79.25,98.04 | v73.91,49.53 73.91,52.07 81.28,59.44 81.28,88.39 82.3,89.41 82.3,93.47 83.06,94.23 83.06,98.04 v84.07,99.06 | v76.45,49.53 76.45,52.32 82.8,58.67 82.8,77.72 v83.82,78.74 | v99.82,124.97 99.06,124.21 99.06,112.52 98.04,111.51 98.04,92.96 97.03,91.95 97.03,56.64 96.39,56.01 v96.39,49.53 | v101.35,119.38 100.58,118.62 100.58,111.76 99.57,110.74 99.57,92.2 98.55,91.19 98.55,56.64 99.19,56.01 v99.19,49.53 | v102.87,114.55 102.11,113.79 102.11,111 101.09,109.98 101.09,91.44 100.08,90.42 100.08,57.28 101.85,55.5 v101.85,49.53 | v103.38,99.82 102.62,99.06 102.62,90.68 101.6,89.66 101.6,57.91 104.39,55.12 v104.39,49.53 | v106.93,49.53 106.93,54.61 103.12,58.42 103.12,88.9 104.14,89.92 104.14,92.71 v104.9,93.47 | v109.47,49.53 109.47,54.36 104.65,59.18 104.65,76.96 v105.41,77.72 | v112.01,49.53 112.01,54.1 | 112.01,54.1 106.17,59.94 106.17,72.14 v106.93,72.9 | 112.01,54.1 117.09,59.18 117.09,92.33 118.49,93.73 118.49,111.38 119.51,112.39 119.51,123.83 v120.4,124.71 | v114.55,49.53 114.55,54.36 118.62,58.42 118.62,91.57 120.02,92.96 120.02,110.62 121.03,111.63 121.03,118.75 v122.05,119.76 | v123.32,114.68 122.56,113.92 122.56,110.87 121.54,109.86 121.54,92.2 120.14,90.81 120.14,57.66 117.09,54.61 v117.09,49.53 | v119.63,49.53 119.63,54.86 121.67,56.9 121.67,90.04 123.06,91.44 123.06,98.81 v123.83,99.57
  Top 0.203: v122.17,49.53 122.17,54.86 123.19,55.88 123.19,89.28 124.59,90.68 124.59,93.22 v125.35,93.98 | v124.71,49.53 124.71,78.49 v125.48,79.25 | v127.25,49.53 127.25,54.86 | 127.25,54.86 126.24,55.88 126.24,72.14 v127,72.9 | 127.25,54.86 137.41,65.02 137.41,92.71 138.68,93.98 138.68,113.03 139.7,114.05 139.7,124.21 v140.46,124.97 | v130.81,49.53 130.81,56.13 138.94,64.26 138.94,91.95 140.21,93.22 140.21,104.65 | 140.21,104.65 140.21,112.27 141.22,113.28 141.22,118.87 v141.99,119.63 | v134.37,49.53 134.37,57.4 140.46,63.5 140.46,91.19 142.24,92.96 142.24,103.89 141.48,104.65 140.21,104.65 | v136.91,49.53 136.91,57.66 141.99,62.74 141.99,90.42 143.76,92.2 143.76,104.65 142.75,105.66 142.75,113.28 v143.51,114.05 | v139.45,49.53 139.45,57.91 143.51,61.98 143.51,89.66 145.29,91.44 145.29,92.71 146.05,93.47 147.32,93.47 149.1,91.69 149.1,90.42 148.59,89.92 146.81,89.92 146.05,89.15 146.05,88.39 | v141.99,49.53 141.99,58.17 145.03,61.21 145.03,87.38 146.05,88.39 | v147.32,49.53 144.27,52.58 144.27,58.17 146.56,60.45 146.56,84.84 147.83,86.11 147.83,87.63 147.07,88.39 146.05,88.39 | v165.1,49.53 165.1,53.34 157.73,60.71 157.73,91.19 158.5,91.95 158.5,110.24 159.51,111.25 159.51,123.95 v160.27,124.71 | v167.64,49.53 167.64,52.83 159.26,61.21 159.26,90.42 160.02,91.19 160.02,109.47 161.04,110.49 161.04,118.11 v161.8,118.87 | v170.43,49.53 170.43,52.32 160.78,61.98 160.78,89.66 161.54,90.42 161.54,108.71 162.56,109.73 162.56,113.54 v163.32,114.3 | v172.97,49.53 172.97,52.07 162.31,62.74 162.31,88.9 163.07,89.66 163.07,98.3 v163.83,99.06 | v175.51,49.53 175.51,51.94 163.83,63.63 163.83,88.14 164.59,88.9 164.59,92.46 v165.35,93.22
  Top 0.203: v178.05,49.53 178.05,51.82 165.35,64.52 165.35,77.98 v166.12,78.74 | v180.59,49.53 180.59,51.56 177.55,54.61 | 177.55,54.61 166.88,65.28 166.88,72.39 v167.64,73.15 | 177.55,54.61 178.31,55.37 178.31,92.96 179.32,93.98 179.32,111.51 180.34,112.52 180.34,123.7 v181.1,124.46 | v183.9,49.53 183.9,52.32 179.83,56.39 179.83,92.2 180.85,93.22 180.85,110.74 181.86,111.76 181.86,113.03 v182.63,113.79 | v187.71,49.53 187.71,50.8 181.36,57.15 181.36,91.44 182.37,92.46 182.37,98.3 v183.13,99.06 | v190.25,49.53 190.25,50.55 182.88,57.91 182.88,90.68 183.9,91.69 183.9,92.46 v184.66,93.22 | v192.79,49.28 192.79,50.29 184.4,58.67 184.4,78.74 v185.17,79.5 | v195.33,49.28 195.33,50.04 | 195.33,50.04 185.93,59.44 185.93,72.14 v186.69,72.9 | 195.33,50.04 198.63,53.34 198.63,93.22 199.64,94.23 199.64,112.14 201.68,114.17 201.68,123.44 v202.44,124.21 | v197.87,49.28 197.87,50.29 200.15,52.58 200.15,92.46 201.17,93.47 201.17,110.49 | 201.17,110.49 201.17,111.38 204.6,114.81 v204.72,114.81 206.5,113.03 206.5,111.25 205.99,110.74 205.99,107.19 204.22,105.41 204.22,91.95 | v200.41,49.28 200.41,50.55 201.68,51.82 201.68,91.69 202.69,92.71 202.69,106.17 204.47,107.95 204.47,109.73 203.71,110.49 201.17,110.49 | v202.95,49.28 202.95,50.8 203.2,51.05 203.2,90.93 204.22,91.95 | v205.49,49.28 205.49,50.55 204.72,51.31 204.72,87.38 205.74,88.39 205.74,90.42 204.22,91.95 | v208.03,49.28 208.03,50.29 206.25,52.07 206.25,86.61 207.26,87.63 207.26,91.19 205.74,92.71 205.74,97.28 v206.5,98.04 | v210.57,49.28 210.57,50.04 207.77,52.83 207.77,85.09 v208.53,85.85 | v210.82,72.52 209.3,70.99 209.3,53.59 213.61,49.28 v215.9,49.28
  Top 0.406: v149.35,86.11 U21.2 | U20.8 210.71,93.36 v210.57,93.22 | U1.8 27.05,114.94 v27.05,113.67 | U11.8 27.05,94.61 v27.05,93.34 | U22.8 26.99,73.34 26.67,73.03 v25.91,73.03 | U23.8 47.31,73.34 46.86,72.9 v45.97,72.9 | U12.8 47.31,93.91 v48.01,93.22 | U3.8 67.63,113.98 v68.2,113.41 | U13.8 67.63,93.66 v68.2,93.09 | U24.8 67.63,73.59 v68.33,72.9 | U25.8 87.95,73.34 v88.52,72.77 | U14.8 87.95,93.66 v88.52,93.09 | U4.8 87.95,113.98 v88.77,113.16 | U5.8 108.27,113.85 v108.71,113.41 | U15.8 108.27,93.79 v108.97,93.09 | U26.8 108.27,73.47 107.7,72.9 v106.93,72.9 | U27.8 128.59,73.47 128.02,72.9 v127,72.9 | U16.8 128.59,93.53 v129.16,92.96 | U6.8 128.59,113.98 v129.03,113.54 | U7.8 148.91,114.23 v149.61,113.54 | U17.8 148.91,93.79 v149.48,93.22 | U8.8 169.23,114.23 v169.93,113.54 | U18.8 169.23,93.91 v169.93,93.22 | U28.8 169.23,73.6 168.78,73.15 v167.64,73.15 | U29.8 189.55,73.47 188.98,72.9 v186.69,72.9 | U19.8 189.55,93.91 v190.25,93.22 | U30.8 209.87,73.47 v210.82,72.52 | U2.8 47.31,113.73 v47.37,113.54
  Top 0.61: LED3.C v23.88,42.93 | LED4.C v92.2,42.93 | LED2.C v160.53,42.93 | LED1.C 227.97,65.02 J1.SLEEVE_SHUNT | U9.8 v186.82,114.94 | U10.8 v207.77,114.94
  Top 1.422: C1.- v12.19,112.78 | C3.- v12.19,92.71 | C5.- v12.19,72.39 | C2.- v227.58,113.03 | C4.- v227.58,92.71 | C6.- v227.58,72.14
  Bottom 0.406: R121.1 v73.91,112.52 | R118.2 69.34,106.17 v68.07,104.9 | R117.2 89.22,104.65 v88.65,104.65 | R112.2 89.41,85.6 v88.39,84.58 | R120.1 v155.19,112.52 | R115.2 151.45,95.18 v151.89,94.74 | C109.2 v149.35,86.11 | R114.2 211.33,86.49 v210.31,85.47 | R116.2 211.33,105.92 v210.31,104.9 | R119.2 89.66,112.27 v88.77,113.16
  Bottom 0.61: R107.16 31.07,4.32 v29.46,4.32 | R104.16 104.73,4.32 v103.12,4.32 | R101.16 178.39,4.32 v176.78,4.32 | R103.16 130.13,4.32 v128.52,4.32 | R102.16 152.99,4.32 v151.38,4.32 | R106.16 53.93,4.32 v52.32,4.32 | R105.16 81.87,4.32 v80.26,4.32 | R100.16 203.79,4.32 v202.18,4.32
  Bottom 0.813: C119.2 29.46,102.87 v27.69,104.65 | C129.2 27.45,125.22 v27.43,125.22 | C107.2 27.83,84.2 v27.81,84.2 | C128.2 47.77,125.22 v47.75,125.22 | C118.2 47.77,104.9 v47.75,104.9 | C106.2 47.77,84.58 v47.75,84.58 | D102.1 78.91,46.82 P4.40 | D100.1 216.07,46.82 P6.40 | C127.2 70.1,123.19 v68.33,124.97 | C117.2 70.1,102.87 v68.07,104.9 | C105.2 70.1,82.55 v68.58,84.07 | C126.2 90.42,123.19 v88.65,124.97 | C116.2 90.42,102.87 v88.65,104.65 | C104.2 88.41,84.58 v88.39,84.58 | C103.2 108.98,84.33 v108.97,84.33 | C115.2 108.98,104.65 v108.97,104.65 | C125.2 108.98,124.97 v108.97,124.97 | C124.2 131.06,123.19 v129.29,124.97 | C114.2 129.05,104.9 v129.03,104.9 | D101.1 147.49,46.82 P5.40 | C102.2 129.05,84.58 v129.03,84.58 | C123.2 151.38,123.19 v149.61,124.97 | C113.2 151.38,102.87 v149.61,104.65 | C122.2 171.7,123.19 v169.93,124.97 | C112.2 171.72,103.11 v169.93,104.9 | C101.2 171.7,82.55 v169.93,84.33 | C121.2 191.01,123.19 v189.23,124.97 | C111.2 192.02,102.87 v189.99,104.9 | C100.2 192.02,82.55 v189.99,84.58 | C108.2 210.33,85.47 v210.31,85.47 | C110.2 212.34,102.87 v210.31,104.9 | C120.2 211.85,123.43 v210.31,124.97
  Bottom 1.422: D103.A v227.33,53.85 v228.6,53.85 v229.87,53.85
  other vias: 12.19,114.3 12.19,94.23 12.19,73.91 227.58,114.55 227.58,94.23 227.58,73.66
  pour GND (isolate 0.254): 2.54,2.54 241.3,2.54 241.3,149.86 2.54,149.86
IEL_DRVH  (via drill 0.41)
  Top 0.203: U1.12 31.62,118.75 v31.5,118.87 | v25.53,119.63 25.91,120.02 U1.4 29.08,120.02 29.46,120.4 29.46,124.97 v30.23,125.73 | v25.53,99.31 25.91,99.69 U11.4 29.08,99.69 29.46,100.08 v29.46,117.86 | U11.12 31.37,98.42 v31.24,98.55 | v25.53,78.99 25.91,79.38 U22.4 28.83,79.38 29.46,80.01 v29.46,97.54 | U22.12 31.37,78.11 v31.24,78.23 | v110.49,128.27 110.49,120.4 110.11,120.02 U5.4 106.93,120.02 v106.55,119.63 | v171.45,128.27 171.45,120.4 171.07,120.02 U8.4 168.15,120.02 v167.51,119.38 | U26.12 v112.65,78.11 | v106.55,78.99 106.93,79.38 U26.4 110.36,79.38 110.74,79.76 v110.74,97.54 | U15.12 112.9,98.42 v112.78,98.55 | v106.68,99.06 107.31,99.69 U15.4 110.36,99.69 110.74,100.08 v110.74,117.86 | U5.12 112.9,118.75 v112.78,118.62 | P2.1 91.44,139.19 92.71,137.92 v92.71,128.27 | P2.5 96.52,139.19 95.25,137.92 v95.25,128.27 | v171.45,117.86 171.45,100.08 171.07,99.69 U18.4 168.02,99.69 v167.39,99.06 | U18.12 173.86,98.42 v173.74,98.3 | U8.12 173.86,118.75 v173.74,118.62 | v171.45,97.54 171.45,79.76 171.07,79.38 U28.4 168.28,79.38 v167.64,78.74 | U28.12 173.86,78.11 v173.74,77.98 | v190.25,128.27 191.01,127.51 191.01,121.41 189.61,120.02 189.48,120.02 | 189.48,120.02 U9.4 | U9.12 190.75,118.75 189.48,120.02
  Bottom 0.203: v31.5,118.87 29.46,118.87 | 29.46,118.87 26.29,118.87 v25.53,119.63 | v25.53,99.31 29.46,99.31 | 29.46,99.31 30.48,99.31 v31.24,98.55 | v25.53,78.99 25.78,79.25 30.23,79.25 v31.24,78.23 | v29.46,97.54 29.46,99.31 | v29.46,117.86 29.46,118.87 | v30.23,125.73 32.77,128.27 v92.71,128.27 v95.25,128.27 v110.49,128.27 v171.45,128.27 v190.25,128.27 | v112.65,78.11 107.44,78.11 v106.55,78.99 | v112.78,98.55 110.74,98.55 | 110.74,98.55 107.19,98.55 v106.68,99.06 | v110.74,97.54 110.74,98.55 | v112.78,118.62 110.74,118.62 | 110.74,118.62 107.57,118.62 v106.55,119.63 | v110.74,117.86 110.74,118.62 | v173.74,98.3 172.97,99.06 171.45,99.06 | v167.39,99.06 171.45,99.06 | v173.74,118.62 172.97,119.38 171.45,119.38 | 171.45,119.38 v167.51,119.38 | v171.45,117.86 171.45,119.38 | v171.45,97.54 171.45,99.06 | v173.74,77.98 172.97,78.74 v167.64,78.74
MB_ATTN_N  (via drill 0.41)
  Top 0.203: P4.30 65.23,47.75 65.23,51.65 61.47,55.46 61.47,74.17 62.87,75.56 v64.26,75.56 | U24.11 75.56,76.83 75.95,77.22 v75.95,77.34
  Bottom 0.203: v75.95,77.34 75.01,76.4 65.1,76.4 v64.26,75.56 | P7.30 64.77,35.56 64.77,45.72 P4.30
MB_ATTN_P  (via drill 0.41)
  Top 0.203: v62.99,76.83 62.36,76.83 60.96,75.44 60.96,55.29 64.82,51.48 64.82,45.72 P4.29 64.77,43.18 64.77,33.02 P7.29 | U24.10 75.56,75.56 75.95,75.18 v75.95,74.93
  Bottom 0.203: v75.95,74.93 74.88,76 66.09,76 64.77,74.68 63.75,74.68 62.99,75.44 v62.99,76.83
MB_C00_N  (via drill 0.41)
  Top 0.203: U2.1 40.51,123.83 v39.62,122.94 38.86,122.17 38.86,109.22 37.85,108.2 37.85,89.15 36.58,87.88 36.58,61.21 44.5,53.29 44.5,45.72 P4.13 44.45,43.18 44.45,33.02 P7.13 | U2.13 55.37,120.02 v55.75,119.63
  Bottom 0.203: v55.75,119.63 54.94,120.45 40.34,120.45 39.62,121.16 v39.62,122.94
MB_C00_P  (via drill 0.41)
  Top 0.203: P4.14 44.91,47.75 44.91,53.52 37.08,61.34 37.08,87.63 38.35,88.9 38.35,107.95 39.37,108.97 39.37,120.65 v40.51,121.79 41.27,122.56 U2.2 | U2.14 55.37,121.28 v55.75,121.67
  Bottom 0.203: v55.75,121.67 54.94,120.85 41.45,120.85 v40.51,121.79 | P7.14 44.45,35.56 44.45,45.72 P4.14
MB_C01_N  (via drill 0.41)
  Top 0.203: P4.16 47.45,47.75 47.45,52.88 38.61,61.72 38.61,86.87 39.88,88.14 39.88,107.19 40.89,108.2 40.89,115.06 42.04,116.2 v43.43,116.2 U2.7 | U2.11 55.37,117.47 v55.75,117.86
  Bottom 0.203: v55.75,117.86 54.94,117.04 44.27,117.04 v43.43,116.2 | P7.16 46.99,35.56 46.99,45.72 P4.16
MB_C01_P  (via drill 0.41)
  Top 0.203: U2.6 41.53,117.47 v40.89,116.84 40.39,116.33 40.39,108.46 39.37,107.44 39.37,88.39 38.1,87.12 38.1,61.59 47.04,52.65 47.04,45.72 P4.15 46.99,43.18 46.99,33.02 P7.15 | U2.10 55.37,116.2 v55.75,115.82
  Bottom 0.203: v55.75,115.82 54.94,116.64 45.26,116.64 43.94,115.32 42.42,115.32 v40.89,116.84
MB_C02_N  (via drill 0.41)
  Top 0.203: U12.1 42.04,103.5 v41.53,103 40.89,102.36 40.89,87.63 39.62,86.36 39.62,62.02 49.58,52.11 49.58,45.72 P4.17 49.53,43.18 49.53,33.02 P7.17 | U12.13 55.24,99.69 55.63,99.31 v55.63,99.06
  Bottom 0.203: v55.63,99.06 54.56,100.13 42.62,100.13 41.53,101.22 v41.53,103
MB_C02_P  (via drill 0.41)
  Top 0.203: P4.18 49.99,47.75 49.99,52.28 40.13,62.19 40.13,86.11 41.4,87.38 41.4,100.58 v42.55,101.73 43.05,102.23 U12.2 | U12.14 55.37,100.97 55.63,101.22 v55.63,101.47
  Bottom 0.203: v55.63,101.47 54.69,100.53 43.74,100.53 v42.55,101.73 | P7.18 49.53,35.56 49.53,45.72 P4.18
MB_C03_N  (via drill 0.41)
  Top 0.203: P4.20 52.53,47.75 52.53,51.77 41.66,62.7 41.66,85.34 42.93,86.61 42.93,93.85 v44.96,95.89 U12.7 | U12.11 55.37,97.16 55.63,97.41 v55.63,97.66
  Bottom 0.203: v55.63,97.66 54.69,96.72 45.8,96.72 v44.96,95.89 | P7.20 52.07,35.56 52.07,45.72 P4.20
MB_C03_P  (via drill 0.41)
  Top 0.203: U12.6 43.56,97.16 v43.05,96.65 42.42,96.01 42.42,86.87 41.15,85.6 41.15,62.53 52.12,51.6 52.12,45.72 P4.19 52.07,43.18 52.07,33.02 P7.19 | U12.10 54.48,95.89 55.24,95.89 55.63,95.5 v55.63,95.25
  Bottom 0.203: v55.63,95.25 54.56,96.32 46.79,96.32 45.47,95 43.94,95 43.05,95.89 v43.05,96.65
MB_C04_N  (via drill 0.41)
  Top 0.203: U23.1 43.81,83.19 v43.31,82.68 42.67,82.04 42.67,62.99 54.66,51 54.66,45.47 P4.21 54.61,43.18 54.61,33.02 P7.21 | U23.13 55.37,79.38 v55.75,78.99
  Bottom 0.203: v55.75,78.99 54.94,79.81 43.64,79.81 42.67,80.77 42.67,82.04 v43.31,82.68
MB_C04_P  (via drill 0.41)
  Top 0.203: P4.22 55.07,47.75 55.07,51.23 43.18,63.12 43.18,80.77 v43.56,81.15 44.32,81.92 U23.2 | U23.14 55.37,80.64 v55.75,81.03
  Bottom 0.203: v55.75,81.03 54.94,80.21 44.5,80.21 v43.56,81.15 | P7.22 54.61,35.56 54.61,45.72 P4.22
MB_C05_N  (via drill 0.41)
  Top 0.203: P4.24 57.61,47.75 57.61,50.6 44.7,63.5 44.7,74.42 v45.85,75.56 U23.7 | U23.11 55.37,76.83 v55.75,77.22
  Bottom 0.203: v55.75,77.22 54.94,76.4 46.69,76.4 v45.85,75.56 | P7.24 57.15,35.56 57.15,45.72 P4.24
MB_C05_P  (via drill 0.41)
  Top 0.203: U23.6 45.34,76.83 v44.83,76.33 44.2,75.69 44.2,63.37 57.2,50.37 57.2,45.72 P4.23 57.15,43.18 57.15,33.02 P7.23 | U23.10 55.37,75.56 v55.75,75.18
  Bottom 0.203: v55.75,75.18 54.94,76 47.04,76 46.74,75.69 46.74,75.18 46.23,74.68 45.47,74.68 44.83,75.31 v44.83,76.33
MB_C06_N  (via drill 0.41)
  Top 0.203: U6.1 v122.56,123.83 121.67,123.83 120.02,122.17 120.02,112.14 119,111.12 119,93.47 117.6,92.08 117.6,58.93 113.08,54.41 113.08,45.72 P5.13 113.03,43.18 113.03,33.02 P8.13 | U6.13 135.64,120.02 136.53,120.02 136.91,119.63 v136.91,119.38
  Bottom 0.203: v136.91,119.38 135.84,120.45 123.77,120.45 122.56,121.67 v122.56,123.83
MB_C06_P  (via drill 0.41)
  Top 0.203: P5.14 113.49,47.75 113.49,54.05 118.11,58.67 118.11,91.82 119.51,93.22 119.51,110.87 120.52,111.89 120.52,121.41 121.67,122.56 v124.08,122.56 U6.2 | U6.14 135.64,121.28 136.53,121.28 136.91,121.67 v136.91,121.92
  Bottom 0.203: v136.91,121.92 135.84,120.85 125.78,120.85 v124.08,122.56 | P8.14 113.03,35.56 113.03,45.72 P5.14
MB_C07_N  (via drill 0.41)
  Top 0.203: P5.16 116.08,47.75 116.08,54.36 119.63,57.91 119.63,91.06 121.03,92.46 121.03,110.11 122.05,111.12 122.05,115.32 122.94,116.2 v125.73,116.2 U6.7 | U6.11 135.64,117.47 136.53,117.47 136.91,117.86 v136.91,118.11
  Bottom 0.203: v136.91,118.11 135.84,117.04 126.57,117.04 v125.73,116.2 | P8.16 115.57,35.56 115.57,45.72 P5.16
MB_C07_P  (via drill 0.41)
  Top 0.203: U6.6 v124.46,117.47 122.43,117.47 121.54,116.59 121.54,111.38 120.52,110.36 120.52,92.71 119.13,91.31 119.13,58.17 115.57,54.61 115.57,45.72 P5.15 115.57,43.18 115.57,33.02 P8.15 | U6.10 135.51,116.2 136.53,116.2 136.91,115.82 v136.91,115.57
  Bottom 0.203: v136.91,115.57 135.84,116.64 127.56,116.64 126.24,115.32 125.22,115.32 124.46,116.08 v124.46,117.47
MB_C08_N  (via drill 0.41)
  Top 0.203: U16.1 v123.7,103.5 122.05,101.85 122.05,91.95 120.65,90.55 120.65,57.4 118.11,54.86 118.11,45.72 P5.17 118.11,43.18 118.11,33.02 P8.17 | U16.13 136.27,99.69 136.53,99.69 136.91,99.31 v136.91,99.06
  Bottom 0.203: v136.91,99.06 135.84,100.13 124.92,100.13 123.7,101.35 v123.7,103.5
MB_C08_P  (via drill 0.41)
  Top 0.203: P5.18 118.62,47.75 118.62,54.61 121.16,57.15 121.16,90.3 122.56,91.69 122.56,101.35 123.44,102.23 v124.71,102.23 U16.2 | U16.14 136.27,100.97 136.53,100.97 136.91,101.35 v136.91,101.6
  Bottom 0.203: v136.91,101.6 135.84,100.53 125.53,100.53 124.71,101.35 v124.71,102.23 | P8.18 118.11,35.56 118.11,45.72 P5.18
MB_C09_N  (via drill 0.41)
  Top 0.203: P5.20 121.16,47.75 121.16,54.86 122.68,56.39 122.68,89.53 124.08,90.93 124.08,95.12 124.84,95.89 v125.98,95.89 U16.7 | U16.11 136.27,97.16 136.53,97.16 136.91,97.54 v136.91,97.79
  Bottom 0.203: v136.91,97.79 135.84,96.72 126.82,96.72 v125.98,95.89 | P8.20 120.65,35.56 120.65,45.72 P5.20
MB_C09_P  (via drill 0.41)
  Top 0.203: U16.6 v124.97,97.16 123.57,95.76 123.57,91.19 122.17,89.79 122.17,56.64 120.65,55.12 120.65,45.72 P5.19 120.65,43.18 120.65,33.02 P8.19 | U16.10 136.53,95.89 136.91,95.5 v136.91,95.25
  Bottom 0.203: v136.91,95.25 135.84,96.32 127.81,96.32 126.49,95 125.48,95 124.97,95.5 v124.97,97.16
MB_C10_N  (via drill 0.41)
  Top 0.203: U27.1 v125.22,83.19 124.59,83.19 123.7,82.3 123.7,55.63 123.19,55.12 123.19,45.72 P5.21 123.19,43.18 123.19,33.02 P8.21 | U27.13 v133.86,79.38
  Bottom 0.203: v133.86,79.38 133.43,79.81 126.44,79.81 125.22,81.03 v125.22,83.19
MB_C10_P  (via drill 0.41)
  Top 0.203: P5.22 123.7,47.75 123.7,54.86 124.21,55.37 124.21,81.28 124.84,81.92 v126.11,81.92 U27.2 | U27.14 v133.86,80.64
  Bottom 0.203: v133.86,80.64 133.43,80.21 126.67,80.21 126.11,80.77 v126.11,81.92 | P8.22 123.19,35.56 123.19,45.72 P5.22
MB_C11_N  (via drill 0.41)
  Top 0.203: P5.24 126.24,47.75 126.24,55.12 125.73,55.63 125.73,74.68 126.62,75.56 v127,75.56 U27.7 | U27.11 v133.86,76.83
  Bottom 0.203: v133.86,76.83 133.43,76.4 127.84,76.4 v127,75.56 | P8.24 125.73,35.56 125.73,45.72 P5.24
MB_C11_P  (via drill 0.41)
  Top 0.203: U27.6 126.62,76.83 v125.98,76.2 125.22,75.44 125.22,55.37 125.73,54.86 125.73,45.72 P5.23 125.73,43.18 125.73,33.02 P8.23 | U27.10 v133.86,75.56
  Bottom 0.203: v133.86,75.56 133.43,76 128.83,76 127.51,74.68 126.49,74.68 125.98,75.18 v125.98,76.2
MB_C12_N  (via drill 0.41)
  Top 0.203: P6.16 185.42,51.52 185.02,51.92 180.34,56.56 180.34,91.95 181.36,92.96 181.36,101.35 183.51,103.5 v184.4,103.5 U19.1 | U19.13 196.72,99.69 196.98,99.69 197.49,99.19 v197.87,99.19
  Bottom 0.203: P9.16 184.15,35.56 184.15,45.72 P6.16 | v197.87,99.19 196.93,100.13 185.37,100.13 184.4,101.09 v184.4,103.5
MB_C12_P  (via drill 0.41)
  Top 0.203: P9.15 184.15,33.02 184.15,43.18 P6.15 186.69,45.72 186.69,51.01 180.85,56.85 180.85,91.69 181.86,92.71 181.86,100.33 183.77,102.23 v185.93,102.23 U19.2 | U19.14 196.98,100.97 197.49,101.47 v197.87,101.47
  Bottom 0.203: v197.87,101.47 196.93,100.53 186.49,100.53 185.93,101.09 v185.93,102.23
MB_C13_N  (via drill 0.41)
  Top 0.203: P9.17 186.69,33.02 186.69,43.18 P6.17 189.23,45.72 189.23,50.8 182.37,57.66 182.37,90.93 183.39,91.95 183.39,94.23 185.04,95.89 v185.93,95.89 U19.7 | U19.11 196.72,97.16 196.98,97.16 197.49,97.66 v197.87,97.66
  Bottom 0.203: v197.87,97.66 196.93,96.72 186.77,96.72 v185.93,95.89
MB_C13_P  (via drill 0.41)
  Top 0.203: P6.18 188.72,47.75 188.72,50.55 181.86,57.4 181.86,91.19 182.88,92.2 182.88,95.5 v183.77,96.39 184.53,97.16 U19.6 | U19.10 196.72,95.89 196.98,95.89 197.49,95.38 v197.87,95.38
  Bottom 0.203: P9.18 186.69,35.56 186.69,45.72 P6.18 | v197.87,95.38 196.93,96.32 188.01,96.32 186.69,95 185.17,95 v183.77,96.39
MB_C14_N  (via drill 0.41)
  Top 0.203: P6.20 191.26,47.75 191.26,50.29 183.39,58.17 183.39,81.79 v184.02,82.42 184.78,83.19 U29.1 | U29.13 196.98,79.38 197.61,78.74 v197.87,78.74
  Bottom 0.203: P9.20 189.23,35.56 189.23,45.72 P6.20 | v197.87,78.74 196.8,79.81 186.64,79.81 v184.02,82.42
MB_C14_P  (via drill 0.41)
  Top 0.203: P9.19 189.23,33.02 189.23,43.18 P6.19 191.77,45.72 191.77,50.55 183.9,58.42 183.9,80.52 185.29,81.92 v186.18,81.92 U29.2 | U29.14 196.98,80.64 197.59,81.25 v197.87,81.25
  Bottom 0.203: v197.87,81.25 197.87,81.28 196.8,80.21 196.32,80.21 187,80.21 186.18,81.03 v186.18,81.92
MB_C15_N  (via drill 0.41)
  Top 0.203: P9.21 191.77,33.02 191.77,43.18 P6.21 194.31,45.72 194.31,50.29 185.42,59.18 185.42,74.17 v186.82,75.56 U29.7 | U29.11 196.98,76.83 197.49,77.34 v197.87,77.34
  Bottom 0.203: v197.87,77.34 197.74,77.22 196.93,76.4 187.66,76.4 v186.82,75.56
MB_C15_P  (via drill 0.41)
  Top 0.203: P6.22 193.8,47.75 193.8,50.04 184.91,58.93 184.91,75.44 v185.55,76.07 186.31,76.83 U29.6 | U29.10 196.98,75.56 197.61,74.93 v197.87,74.93
  Bottom 0.203: P9.22 191.77,35.56 191.77,45.72 P6.22 | v197.87,74.93 196.8,76 189.03,76 187.45,74.42 186.44,74.42 185.55,75.31 v185.55,76.07
MB_CPA_N2  (via drill 0.41)
  Top 0.203: P6.24 196.34,47.75 196.34,50.29 199.14,53.09 199.14,92.96 200.15,93.98 200.15,112.05 202.49,114.38 202.49,122.48 203.84,123.83 v205.23,123.83 U10.1 | U10.13 217.55,120.02 v217.93,119.63
  Bottom 0.203: P9.24 194.31,35.56 194.31,45.72 P6.24 | v217.93,119.63 217.17,120.4 206.25,120.4 205.23,121.41 v205.23,123.83
MB_CPA_P  (via drill 0.41)
  Top 0.203: P9.23 194.31,33.02 194.31,43.18 P6.23 196.85,45.72 196.85,50.04 199.64,52.83 199.64,92.71 200.66,93.73 200.66,111.98 202.9,114.22 202.9,121.41 204.04,122.56 v206.25,122.56 U10.2 | U10.14 217.68,121.28 v217.93,121.54
  Bottom 0.203: v217.93,121.54 217.3,120.9 206.76,120.9 206.25,121.41 v206.25,122.56
MB_CTOD_N  (via drill 0.41)
  Top 0.203: P4.34 71.12,48.26 70.61,48.77 70.61,51.82 79.25,60.45 79.25,89.41 80.26,90.42 80.26,95.25 v80.77,95.76 | U14.7 83.95,95.89 v83.82,95.76
  Bottom 0.203: v83.82,95.76 v80.77,95.76 | P7.34 69.85,35.56 69.85,45.72 P4.34
MB_CTOD_P  (via drill 0.41)
  Top 0.203: v80.77,97.03 79.76,96.01 79.76,90.68 78.74,89.66 78.74,60.71 70.1,52.07 70.1,48.77 69.9,48.56 69.9,45.72 P4.33 69.85,43.18 69.85,33.02 P7.33 | U14.6 83.95,97.16 v83.82,97.03
  Bottom 0.203: v80.77,97.03 v83.82,97.03
MB_D00_N  (via drill 0.41)
  Top 0.203: U1.13 35.05,120.02 v35.43,119.63 | U1.1 19.68,123.83 v18.54,122.68 18.03,122.17 18.03,86.61 16.76,85.34 16.76,69 29.01,56.76 29.01,45.97 P4.1 28.96,42.93 28.96,33.27 P7.1
  Bottom 0.203: v35.43,119.63 34.62,120.45 19,120.45 18.54,120.9 v18.54,122.68
MB_D00_P  (via drill 0.41)
  Top 0.203: P4.2 29.41,48.01 29.41,57.03 17.27,69.17 17.27,85.09 18.54,86.36 18.54,120.65 v19.56,121.67 20.45,122.56 U1.2 | U1.14 35.05,121.28 v35.43,121.67
  Bottom 0.203: v35.43,121.67 34.62,120.85 20.37,120.85 v19.56,121.67 | P4.2 29.01,45.72 29.01,35.76 P7.2
MB_D01_N  (via drill 0.41)
  Top 0.203: P4.4 32.21,47.75 32.21,56.27 18.8,69.68 18.8,84.33 20.07,85.6 20.07,115.57 20.7,116.2 v21.72,116.2 U1.7 | U1.11 35.05,117.47 v35.43,117.86
  Bottom 0.203: v35.43,117.86 34.67,117.09 22.61,117.09 v21.72,116.2 | P7.4 31.75,35.56 31.75,45.72 P4.4
MB_D01_P  (via drill 0.41)
  Top 0.203: U1.6 20.7,117.47 v20.19,116.97 19.56,116.33 19.56,85.85 18.29,84.58 18.29,69.47 31.8,55.96 31.8,45.72 P4.3 31.75,43.18 31.75,33.02 P7.3 | U1.10 35.05,116.2 v35.43,115.82
  Bottom 0.203: v35.43,115.82 34.67,116.59 23.37,116.59 22.1,115.32 21.08,115.32 20.19,116.2 v20.19,116.97
MB_D02_N  (via drill 0.41)
  Top 0.203: U11.1 22.73,103.5 v21.59,102.36 21.08,101.85 21.08,85.09 19.81,83.82 19.81,70.03 34.34,55.5 34.34,45.72 P4.5 34.29,43.18 34.29,33.02 P7.5 | U11.13 35.05,99.69 v35.43,99.31
  Bottom 0.203: v35.43,99.31 34.62,100.13 22.3,100.13 21.59,100.84 v21.59,102.36
MB_D02_P  (via drill 0.41)
  Top 0.203: P4.6 34.75,47.75 34.75,55.75 20.32,70.18 20.32,83.57 21.59,84.84 21.59,100.58 v22.61,101.6 23.24,102.23 U11.2 | U11.14 35.05,100.97 v35.43,101.35
  Bottom 0.203: v35.43,101.35 34.62,100.53 23.67,100.53 v22.61,101.6 | P4.6 34.29,45.72 34.29,35.56 P7.6
MB_D03_N  (via drill 0.41)
  Top 0.203: P4.8 37.29,47.75 37.29,55.25 21.84,70.7 21.84,82.8 23.11,84.07 23.11,94.23 v24.64,95.76 24.77,95.89 U11.7 | U11.11 35.05,97.16 v35.43,97.54
  Bottom 0.203: v35.43,97.54 34.62,96.72 25.6,96.72 v24.64,95.76 | P7.8 36.83,35.56 36.83,45.72 P4.8
MB_D03_P  (via drill 0.41)
  Top 0.203: U11.6 23.75,97.16 v23.24,96.65 22.61,96.01 22.61,84.33 21.34,83.06 21.34,70.53 36.88,54.98 36.88,45.72 P4.7 36.83,43.18 36.83,33.02 P7.7 | U11.10 35.05,95.89 v35.43,95.5
  Bottom 0.203: v35.43,95.5 34.62,96.32 26.47,96.32 24.89,94.74 24.13,94.74 23.24,95.63 v23.24,96.65
MB_D04_N  (via drill 0.41)
  Top 0.203: U22.1 24.26,83.19 v23.62,82.55 22.86,81.79 22.86,70.99 39.42,54.43 39.42,45.72 P4.9 39.37,43.18 39.37,33.02 P7.9 | U22.13 34.92,79.38 35.31,78.99 v35.31,78.74
  Bottom 0.203: v35.31,78.74 34.24,79.81 23.57,79.81 22.86,80.52 22.86,81.79 v23.62,82.55
MB_D04_P  (via drill 0.41)
  Top 0.203: P4.10 39.83,47.75 39.83,54.66 23.37,71.12 23.37,80.77 v23.75,81.15 24.51,81.92 U22.2 | U22.14 35.05,80.64 35.31,80.9 v35.31,81.15
  Bottom 0.203: v35.31,81.15 34.37,80.21 24.43,80.21 v23.75,81.15 | P7.10 39.37,35.56 39.37,45.72 P4.10
MB_D05_N  (via drill 0.41)
  Top 0.203: P4.12 42.37,47.75 42.37,54.15 24.89,71.63 24.89,75.18 v25.27,75.56 U22.7 | U22.11 35.05,76.83 35.31,77.09 v35.31,77.34
  Bottom 0.203: v35.31,77.34 34.37,76.4 26.11,76.4 v25.27,75.56 | P7.12 41.91,35.56 41.91,45.72 P4.12
MB_D05_P  (via drill 0.41)
  Top 0.203: U22.6 25.02,76.83 v24.89,76.71 24.38,76.2 24.38,71.37 41.96,53.8 41.96,45.72 P4.11 41.91,43.18 41.91,33.02 P7.11 | U22.10 34.92,75.56 35.31,75.18 v35.31,74.93
  Bottom 0.203: v35.31,74.93 34.24,76 27.23,76 25.65,74.42 24.64,74.42 24.38,74.68 24.38,76.2 v24.89,76.71
MB_D06_N  (via drill 0.41)
  Top 0.203: U5.1 v103.63,123.83 101.47,123.83 99.57,121.92 99.57,112.27 98.55,111.25 98.55,92.71 97.54,91.69 97.54,45.97 P5.1 97.54,42.93 97.54,33.27 P8.1 | U5.13 116.08,120.02 116.2,120.02 116.71,119.51 v116.71,119.38
  Bottom 0.203: v116.71,119.38 115.65,120.45 105.11,120.45 103.63,121.92 v103.63,123.83
MB_D06_P  (via drill 0.41)
  Top 0.203: P5.2 98.04,48.01 98.04,91.44 99.06,92.46 99.06,111 100.08,112.01 100.08,120.65 101.98,122.56 v105.41,122.56 | U5.2 v105.41,122.56 | U5.14 116.08,121.28 116.2,121.28 116.71,121.79 v116.71,121.92 | v105.41,122.56 105.66,122.56